# Altium project CHEM_CONTROL_BOX.PrjPcb (part 1 of 2)
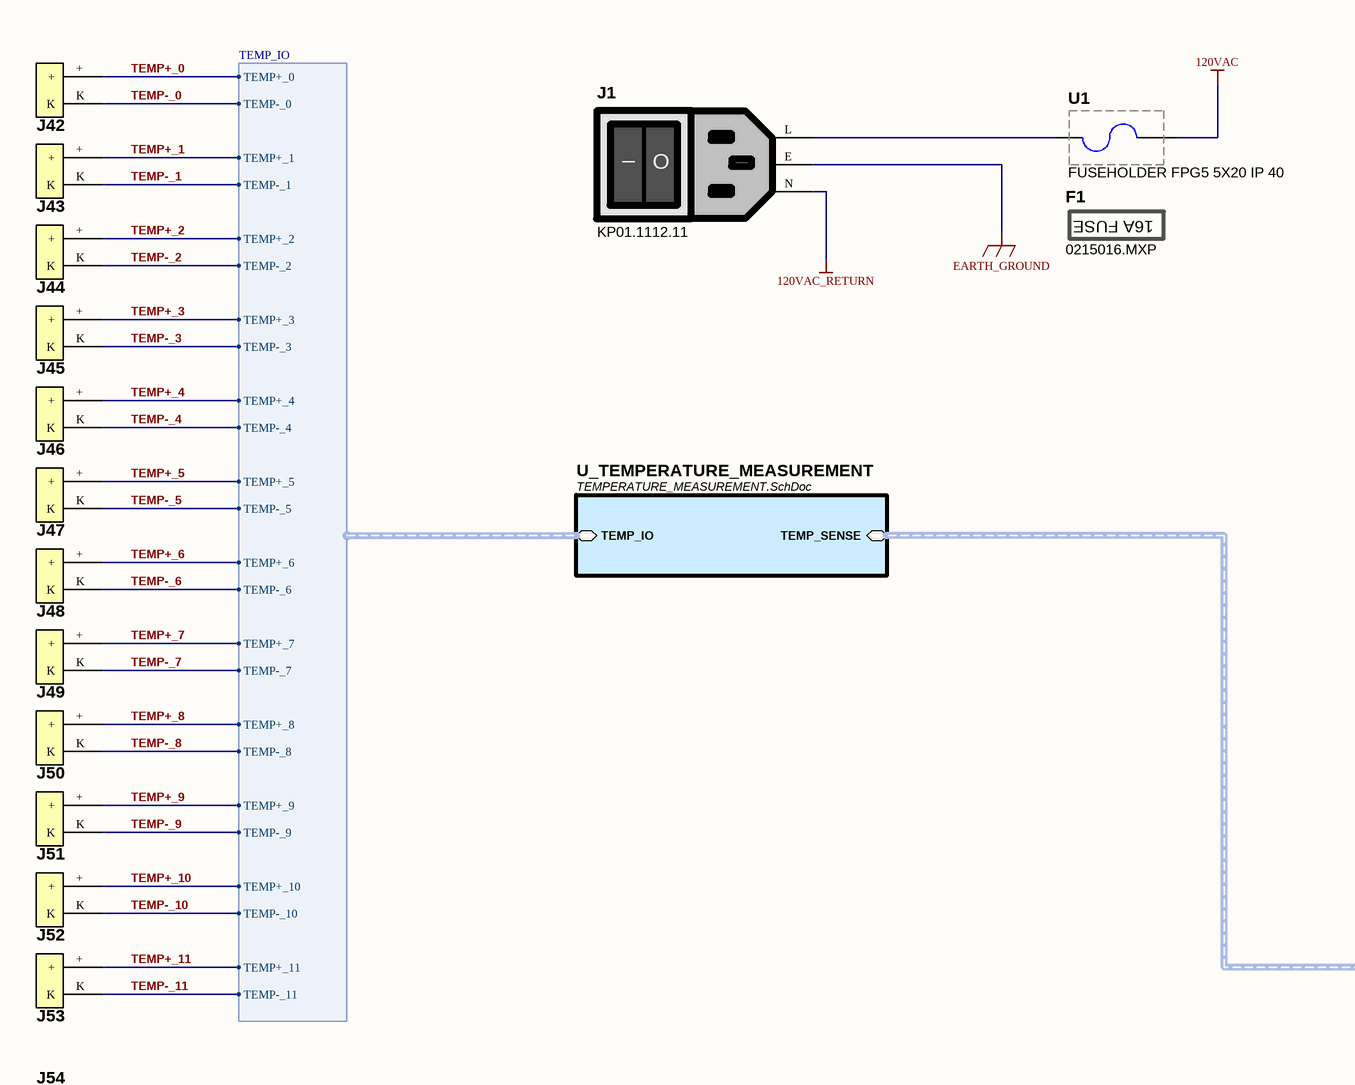
[diagram p0: CHEM_CONTROL_BOX.SchDoc, top left]
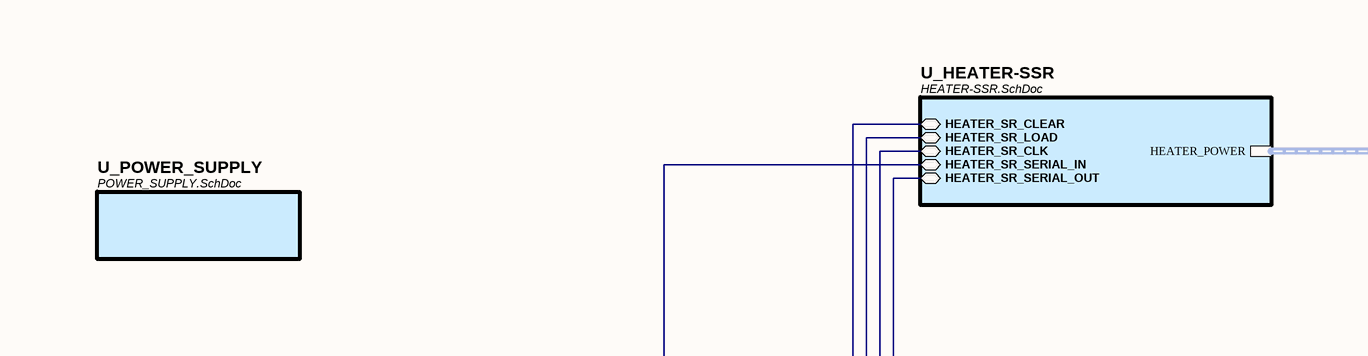
[diagram p1: CHEM_CONTROL_BOX.SchDoc, top middle]
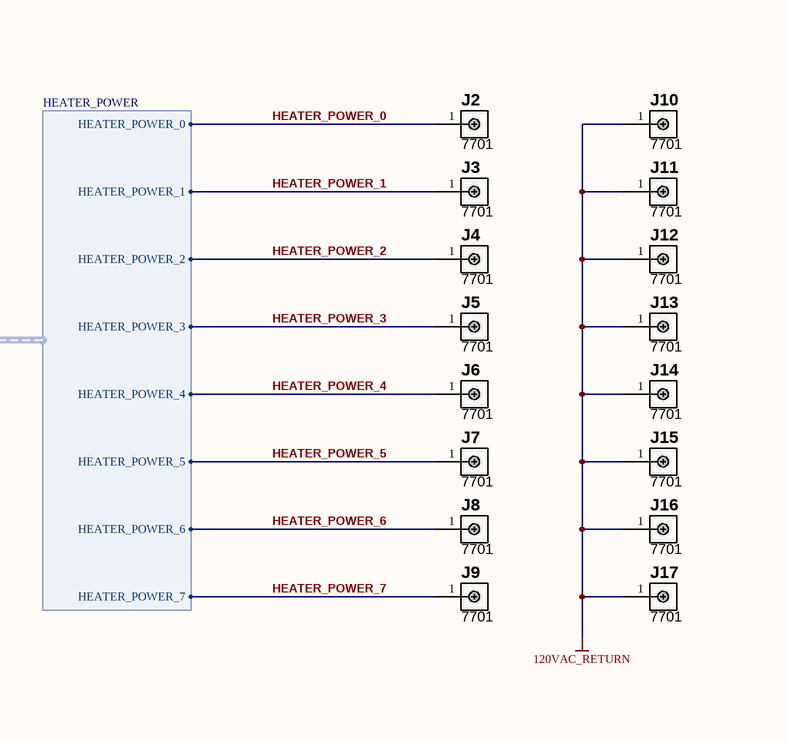
[diagram p2: CHEM_CONTROL_BOX.SchDoc, top right]
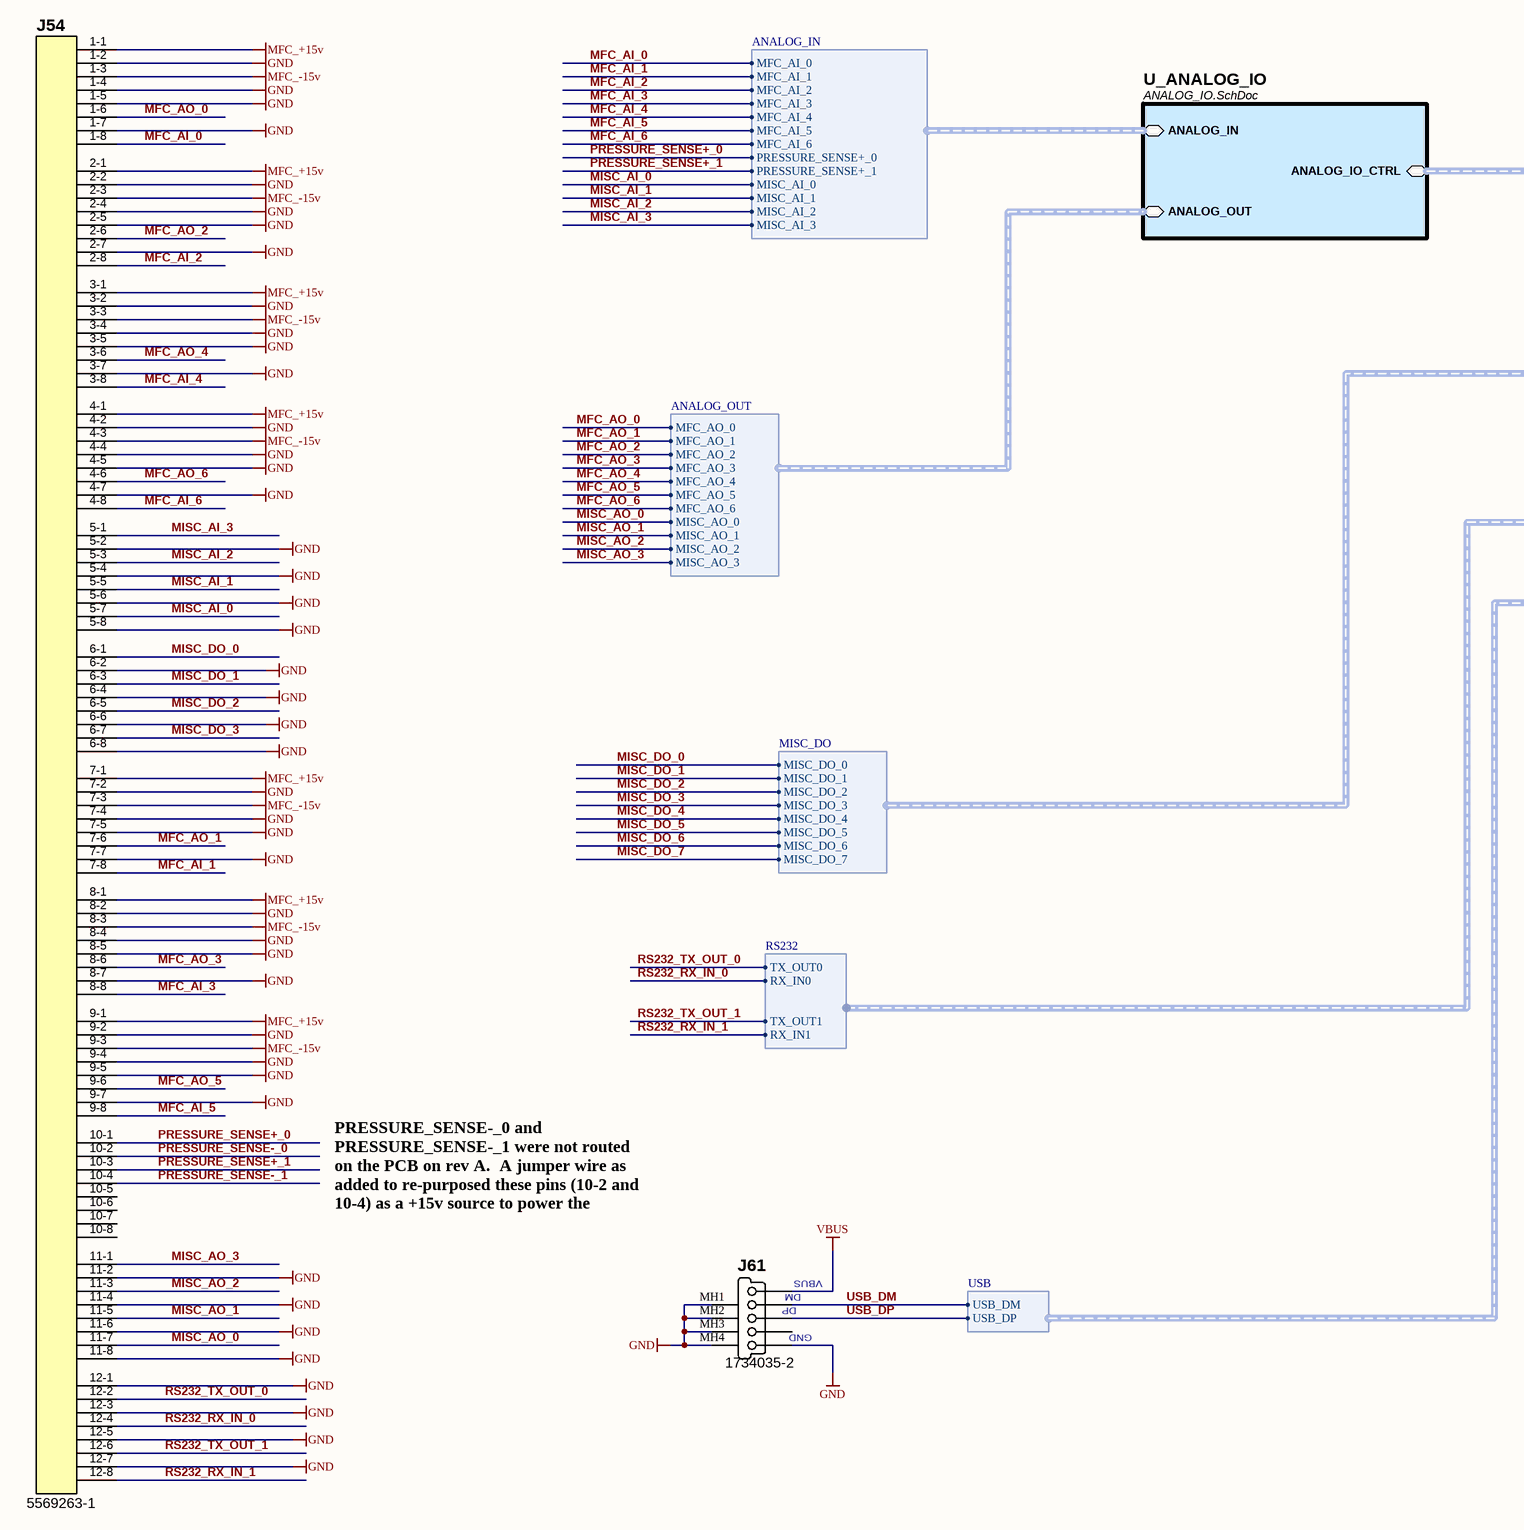
[diagram p3: CHEM_CONTROL_BOX.SchDoc, bottom left]
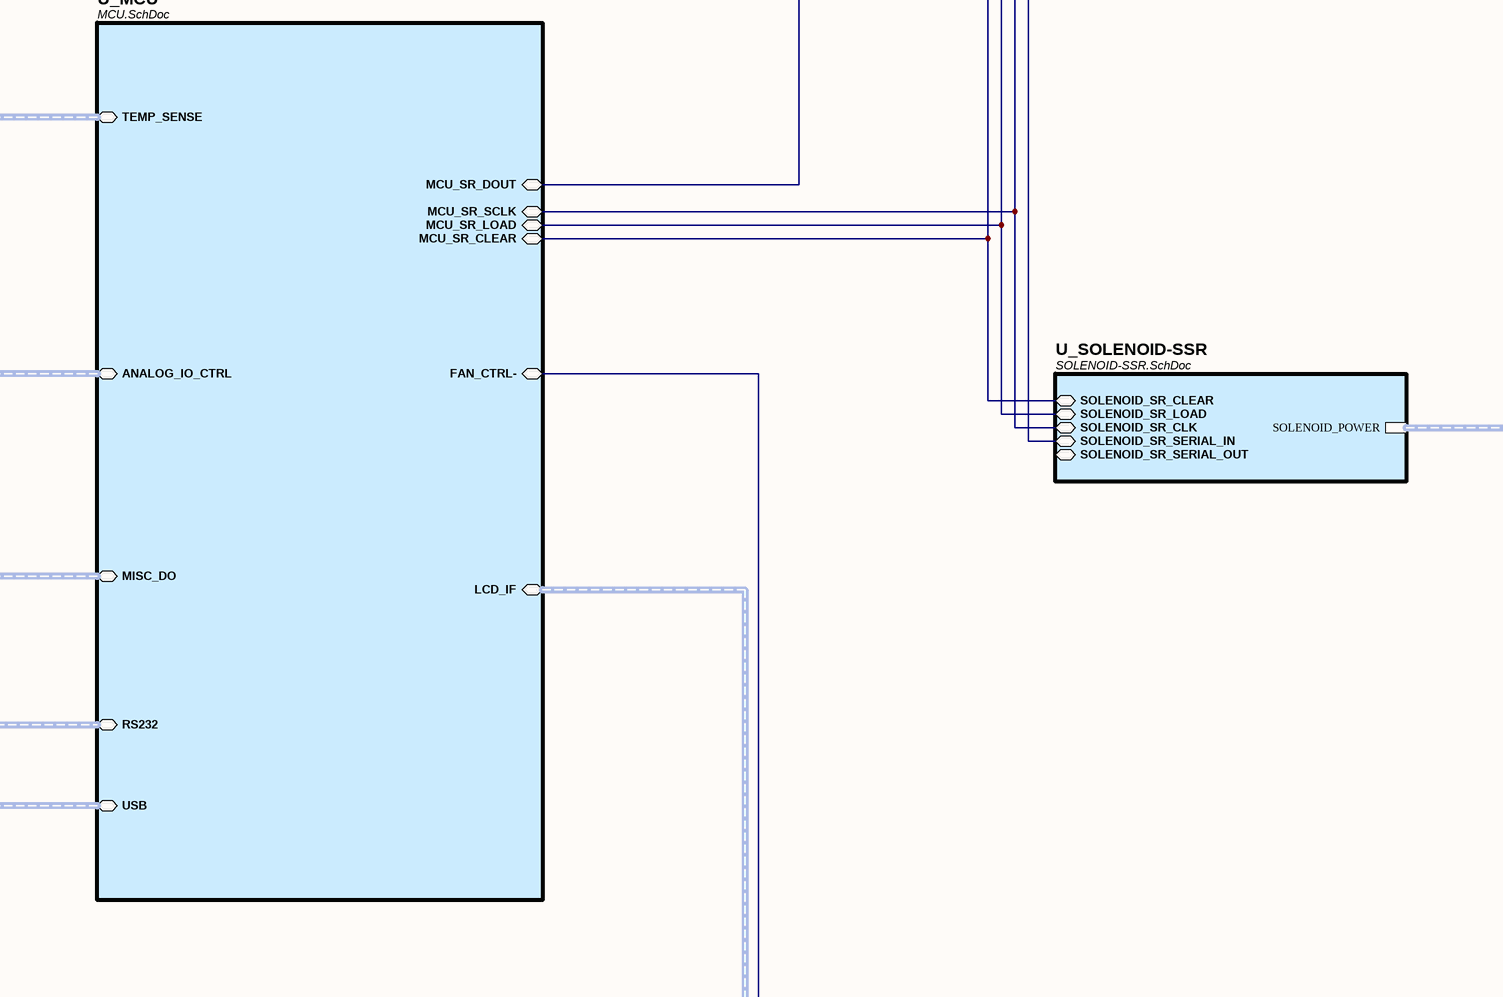
[diagram p4: CHEM_CONTROL_BOX.SchDoc, bottom middle]
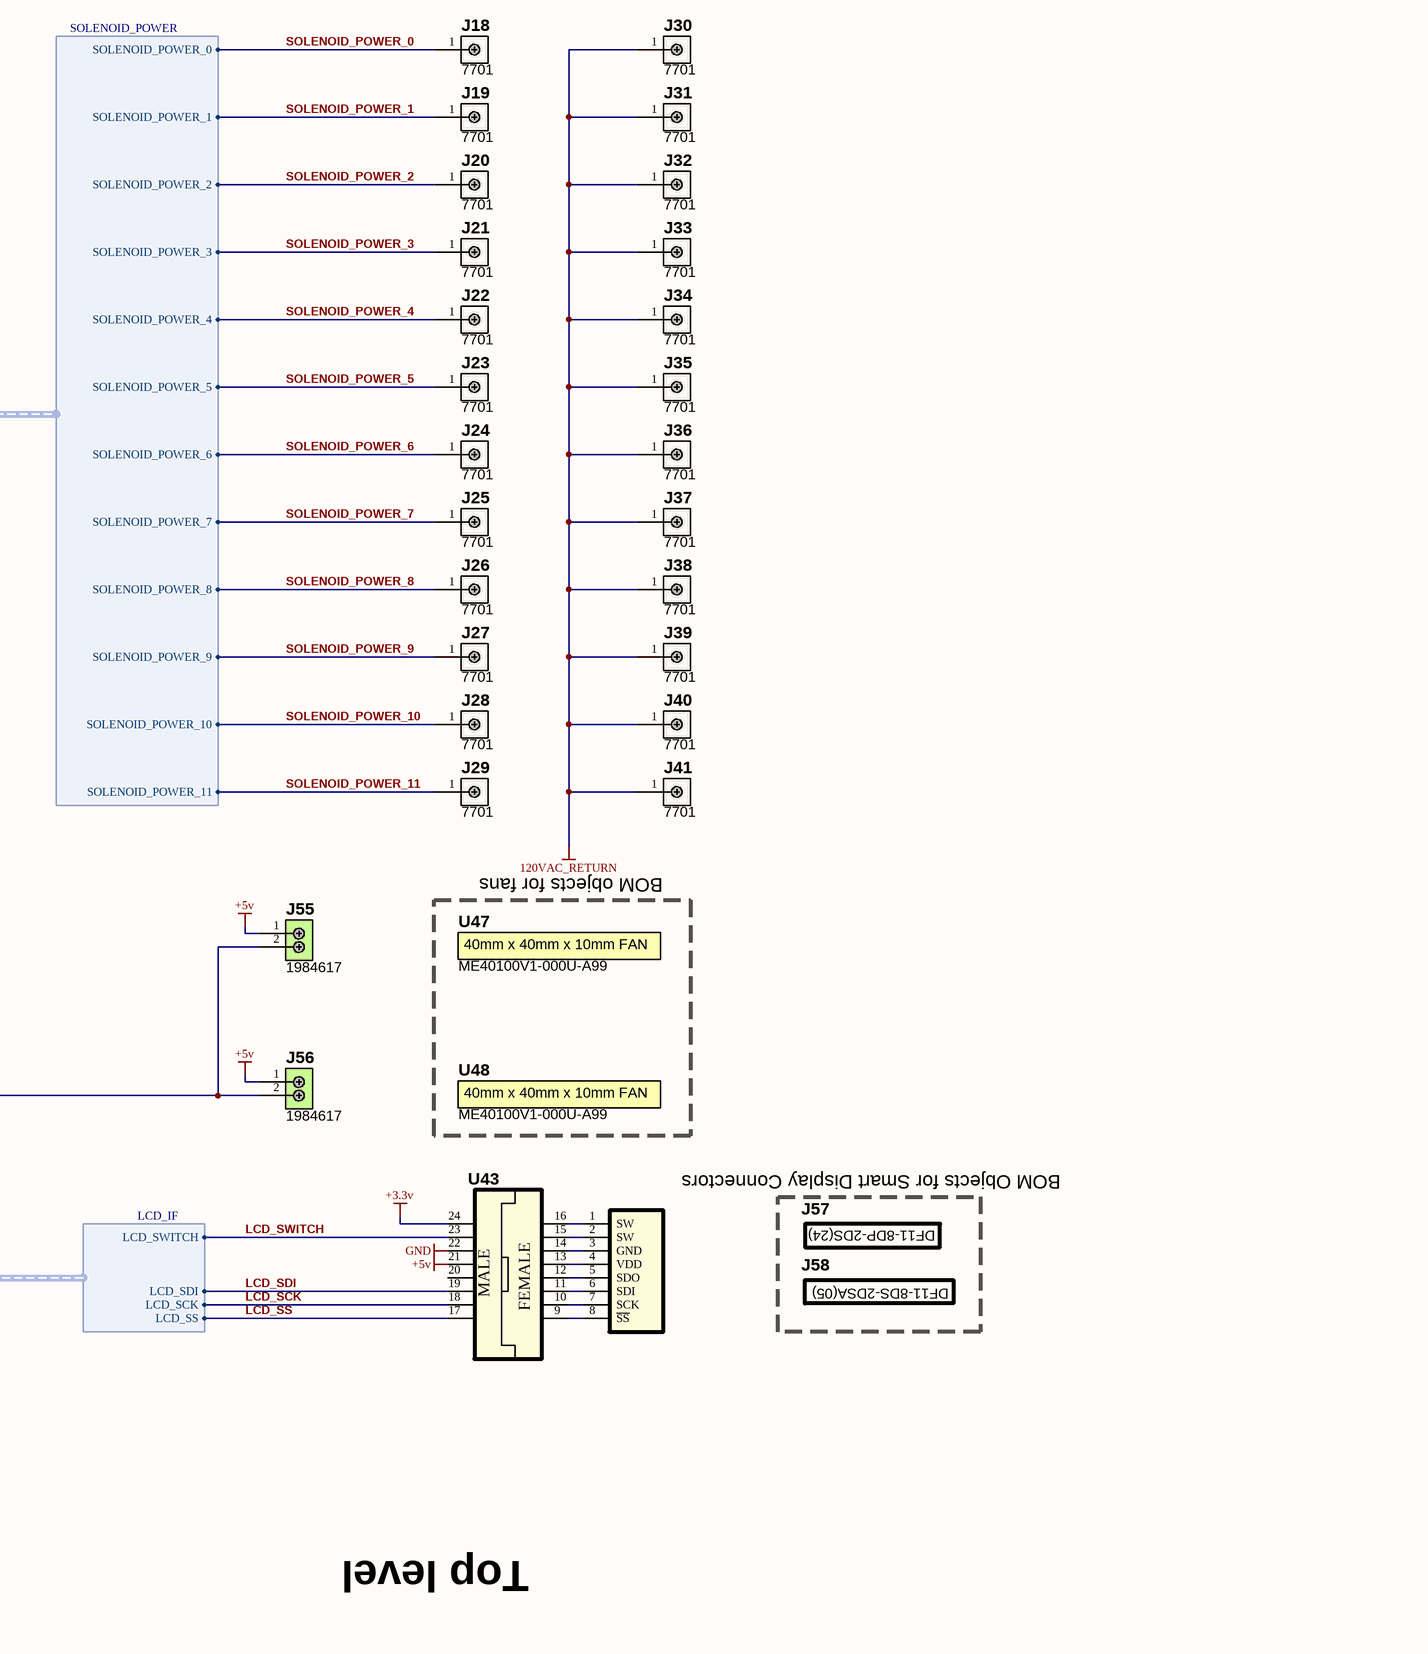
[diagram p5: CHEM_CONTROL_BOX.SchDoc, bottom right]
BOM_NOTES_LINE_1: -; BOM_NOTES_LINE_2: -; BOM_NOTES_LINE_3: -; BOM_NOTES_LINE_4: -; PCB_COPPER_WEIGHT_INNER: 2oz; PCB_COPPER_WEIGHT_OUTER: 2oz; PCB_DIMENSION_X: -; PCB_DIMENSION_Y: -; PCB_DRC_DATE: 2013.01.2; PCB_FINISH_PLATING: LEAD FREE HASL; PCB_FINISHED_THICKNESS: .0625"; PCB_LAYERS: 2; PCB_MATERIAL: FR4; PCB_MIN_DRILL: 15mil; PCB_MIN_TRACE_SPACE: 8mil; PCB_MIN_TRACE_WIDTH: 8mil; PCB_PRINTOUT_SCALE: 1:1; PCB_SILKSCREEN_COLOR_BOTTOM: WHITE; PCB_SILKSCREEN_COLOR_TOP: WHITE; PCB_SOLDER_MASK_COLOR_BOTTOM: BLUE; PCB_SOLDER_MASK_COLOR_TOP: BLUE; PROJECT_ENGINEER: E.Hughes; PROJECT_PART_NUMBER_CCA: -; PROJECT_PART_NUMBER_PCB: -; PROJECT_PART_NUMBER_SCH: -; PROJECT_REVISION: b; PROJECT_SHORT_TITLE: CHEM_BOX; PROJECT_STATUS: PROTOTYPE; PROJECT_TITLE_LINE_1: Chem Control Box; SCH_DATE: 2014.1.2
5 sheets, 215 parts. Net scope: hierarchical (ports join the sheet entries above them; power ports are global).
Board file: CHEM_CONTROL_BOX.PcbDoc
Sheets:
  CHEM_CONTROL_BOX.SchDoc
    U_MCU = MCU.SchDoc
    U_POWER_SUPPLY = POWER_SUPPLY.SchDoc
    U_TEMPERATURE_MEASUREMENT = TEMPERATURE_MEASUREMENT.SchDoc
    U_ANALOG_IO = ANALOG_IO.SchDoc

## Sheet CHEM_CONTROL_BOX.SchDoc
size D; Organization: Altium Limited; Address1: 3 Minna Close; Address2: Belrose; Address3: NSW 2085; Address4: Australia; SheetNumber: 1; SheetTotal: 7

### Parts
F1  0215016.MXP  (mechanical)
J1  KP01.1112.11  [KP01.1112.11]
J2  7701  [7701]
J3  7701  [7701]
J4  7701  [7701]
J5  7701  [7701]
J6  7701  [7701]
J7  7701  [7701]
J8  7701  [7701]
J9  7701  [7701]
J10  7701  [7701]
J11  7701  [7701]
J12  7701  [7701]
J13  7701  [7701]
J14  7701  [7701]
J15  7701  [7701]
J16  7701  [7701]
J17  7701  [7701]
J18  7701  [7701]
J19  7701  [7701]
J20  7701  [7701]
J21  7701  [7701]
J22  7701  [7701]
J23  7701  [7701]
J24  7701  [7701]
J25  7701  [7701]
J26  7701  [7701]
J27  7701  [7701]
J28  7701  [7701]
J29  7701  [7701]
J30  7701  [7701]
J31  7701  [7701]
J32  7701  [7701]
J33  7701  [7701]
J34  7701  [7701]
J35  7701  [7701]
J36  7701  [7701]
J37  7701  [7701]
J38  7701  [7701]
J39  7701  [7701]
J40  7701  [7701]
J41  7701  [7701]
J42  PCC-SMP-K  [PCC-SMP-V]  (value not drawn)
J43  PCC-SMP-K  [PCC-SMP-V]  (value not drawn)
J44  PCC-SMP-K  [PCC-SMP-V]  (value not drawn)
J45  PCC-SMP-K  [PCC-SMP-V]  (value not drawn)
J46  PCC-SMP-K  [PCC-SMP-V]  (value not drawn)
J47  PCC-SMP-K  [PCC-SMP-V]  (value not drawn)
J48  PCC-SMP-K  [PCC-SMP-V]  (value not drawn)
J49  PCC-SMP-K  [PCC-SMP-V]  (value not drawn)
J50  PCC-SMP-K  [PCC-SMP-V]  (value not drawn)
J51  PCC-SMP-K  [PCC-SMP-V]  (value not drawn)
J52  PCC-SMP-K  [PCC-SMP-V]  (value not drawn)
J53  PCC-SMP-K  [PCC-SMP-V]  (value not drawn)
J54  5569263-1  [5569263-1]
J55  1984617  [1984617]
J56  1984617  [1984617]
J57  DF11-8DP-2DS(24)  (value not drawn)  (mechanical)
J58  DF11-8DS-2DSA(05)  (value not drawn)  (mechanical)
J61  1734035-2  [1734035-2]
U1  FUSEHOLDER FPG5 5X20 IP 40  [3101.0055]
U43  IS15DSBFP4RGB  [R/A IS15DSBFP4RGB]  (value not drawn)
U47  ME40100V1-000U-A99  [ME40100V1-000U-A99]
U48  ME40100V1-000U-A99  [ME40100V1-000U-A99]

### Sub-sheets
U_ANALOG_IO = ANALOG_IO.SchDoc: ANALOG_IN (harness ANALOG_IN), ANALOG_OUT (harness ANALOG_OUT), ANALOG_IO_CTRL (harness ANALOG_IO_CTRL)
U_HEATER-SSR = HEATER-SSR.SchDoc (file not in this document): HEATER_POWER (harness HEATER_POWER), HEATER_SR_CLEAR, HEATER_SR_LOAD, HEATER_SR_CLK, HEATER_SR_SERIAL_IN, HEATER_SR_SERIAL_OUT
U_MCU = MCU.SchDoc: ANALOG_IO_CTRL (harness ANALOG_IO_CTRL), TEMP_SENSE (harness TEMP_SENSE), LCD_IF (harness LCD_IF), FAN_CTRL-, MISC_DO (harness MISC_DO), RS232 (harness RS232), MCU_SR_DOUT, MCU_SR_SCLK, MCU_SR_LOAD, MCU_SR_CLEAR, USB (harness USB)
U_POWER_SUPPLY = POWER_SUPPLY.SchDoc: no entries
U_SOLENOID-SSR = SOLENOID-SSR.SchDoc (file not in this document): SOLENOID_POWER (harness SOLENOID_POWER), SOLENOID_SR_CLEAR, SOLENOID_SR_LOAD, SOLENOID_SR_CLK, SOLENOID_SR_SERIAL_IN, SOLENOID_SR_SERIAL_OUT
U_TEMPERATURE_MEASUREMENT = TEMPERATURE_MEASUREMENT.SchDoc: TEMP_IO (harness TEMP_IO), TEMP_SENSE (harness TEMP_SENSE)

### Harnesses
HEATER_POWER: HEATER_POWER_0, HEATER_POWER_1, HEATER_POWER_2, HEATER_POWER_3, HEATER_POWER_4, HEATER_POWER_5, HEATER_POWER_6, HEATER_POWER_7
SOLENOID_POWER: SOLENOID_POWER_0, SOLENOID_POWER_1, SOLENOID_POWER_2, SOLENOID_POWER_3, SOLENOID_POWER_4, SOLENOID_POWER_5, SOLENOID_POWER_6, SOLENOID_POWER_7, SOLENOID_POWER_8, SOLENOID_POWER_9, SOLENOID_POWER_10, SOLENOID_POWER_11
TEMP_IO: TEMP-_0, TEMP+_0, TEMP+_1, TEMP-_1, TEMP+_2, TEMP-_2, TEMP+_3, TEMP-_3, TEMP+_4, TEMP-_4, TEMP+_5, TEMP-_5, TEMP+_6, TEMP-_6, TEMP+_7, TEMP-_7, TEMP+_8, TEMP-_8, TEMP+_9, TEMP-_9, TEMP+_10, TEMP-_10, TEMP+_11, TEMP-_11
ANALOG_OUT: MFC_AO_0, MFC_AO_1, MFC_AO_2, MFC_AO_3, MFC_AO_4, MFC_AO_5, MFC_AO_6, MISC_AO_0, MISC_AO_1, MISC_AO_2, MISC_AO_3
ANALOG_IN: MFC_AI_0, MFC_AI_1, MFC_AI_2, MFC_AI_3, MFC_AI_4, MFC_AI_5, MFC_AI_6, PRESSURE_SENSE+_0, PRESSURE_SENSE+_1, MISC_AI_0, MISC_AI_1, MISC_AI_2, MISC_AI_3
LCD_IF: LCD_SWITCH, LCD_SDI, LCD_SCK, LCD_SS
MISC_DO: MISC_DO_0, MISC_DO_1, MISC_DO_2, MISC_DO_3, MISC_DO_4, MISC_DO_5, MISC_DO_6, MISC_DO_7
RS232: TX_OUT0, RX_IN0, TX_OUT1, RX_IN1
USB: USB_DM, USB_DP

### Nets
120VAC: U1.2
120VAC_RETURN: J1.N J10.1 J11.1 J12.1 J13.1 J14.1 J15.1 J16.1 J17.1 J30.1 J31.1 J32.1 J33.1 J34.1 J35.1 J36.1 J37.1 J38.1 J39.1 J40.1 J41.1
+3.3v: U43.24
+5v: J55.1 J56.1 U43.21
EARTH_GROUND: J1.E(G)
GND: J54.1-2 J54.1-4 J54.1-5 J54.1-7 J54.2-2 J54.2-4 J54.2-5 J54.2-7 J54.3-2 J54.3-4 J54.3-5 J54.3-7 J54.4-2 J54.4-4 J54.4-5 J54.4-7 J54.5-2 J54.5-4 J54.5-6 J54.5-8 J54.6-2 J54.6-4 J54.6-6 J54.6-8 J54.7-2 J54.7-4 J54.7-5 J54.7-7 J54.8-2 J54.8-4 J54.8-5 J54.8-7 J54.9-2 J54.9-4 J54.9-5 J54.9-7 J54.11-2 J54.11-4 J54.11-6 J54.11-8 J54.12-1 J54.12-3 J54.12-5 J54.12-7 J61.5(GND) J61.MH1(Tab) J61.MH2(Tab) J61.MH3(Tab) J61.MH4(Tab) U43.22
MFC_+15v: J54.1-1 J54.2-1 J54.3-1 J54.4-1 J54.7-1 J54.8-1 J54.9-1
MFC_-15v: J54.1-3 J54.2-3 J54.3-3 J54.4-3 J54.7-3 J54.8-3 J54.9-3
VBUS: J61.1(V_BUS_(5V))
HEATER_POWER_0: J2.1 ; sheet U_HEATER-SSR/HEATER_POWER.HEATER_POWER_0
HEATER_POWER_1: J3.1 ; sheet U_HEATER-SSR/HEATER_POWER.HEATER_POWER_1
HEATER_POWER_2: J4.1 ; sheet U_HEATER-SSR/HEATER_POWER.HEATER_POWER_2
HEATER_POWER_3: J5.1 ; sheet U_HEATER-SSR/HEATER_POWER.HEATER_POWER_3
HEATER_POWER_4: J6.1 ; sheet U_HEATER-SSR/HEATER_POWER.HEATER_POWER_4
HEATER_POWER_5: J7.1 ; sheet U_HEATER-SSR/HEATER_POWER.HEATER_POWER_5
HEATER_POWER_6: J8.1 ; sheet U_HEATER-SSR/HEATER_POWER.HEATER_POWER_6
HEATER_POWER_7: J9.1 ; sheet U_HEATER-SSR/HEATER_POWER.HEATER_POWER_7
LCD_SCK: U43.18 ; sheet U_HEATER-SSR/HEATER_SR_CLK, sheet U_SOLENOID-SSR/SOLENOID_SR_CLK, sheet U_MCU/MCU_SR_SCLK, sheet U_MCU/LCD_IF.LCD_SCK
LCD_SDI: U43.19 ; sheet U_MCU/LCD_IF.LCD_SDI
LCD_SS: U43.17 ; sheet U_MCU/LCD_IF.LCD_SS
LCD_SWITCH: U43.23 ; sheet U_MCU/LCD_IF.LCD_SWITCH
MCU_SR_CLEAR: sheet U_HEATER-SSR/HEATER_SR_CLEAR, sheet U_SOLENOID-SSR/SOLENOID_SR_CLEAR, sheet U_MCU/MCU_SR_CLEAR
MCU_SR_DOUT: sheet U_HEATER-SSR/HEATER_SR_SERIAL_IN, sheet U_MCU/MCU_SR_DOUT
MCU_SR_LOAD: sheet U_HEATER-SSR/HEATER_SR_LOAD, sheet U_SOLENOID-SSR/SOLENOID_SR_LOAD, sheet U_MCU/MCU_SR_LOAD
MFC_AI_0: J54.1-8 ; sheet U_ANALOG_IO/ANALOG_IN.MFC_AI_0
MFC_AI_1: J54.7-8 ; sheet U_ANALOG_IO/ANALOG_IN.MFC_AI_1
MFC_AI_2: J54.2-8 ; sheet U_ANALOG_IO/ANALOG_IN.MFC_AI_2
MFC_AI_3: J54.8-8 ; sheet U_ANALOG_IO/ANALOG_IN.MFC_AI_3
MFC_AI_4: J54.3-8 ; sheet U_ANALOG_IO/ANALOG_IN.MFC_AI_4
MFC_AI_5: J54.9-8 ; sheet U_ANALOG_IO/ANALOG_IN.MFC_AI_5
MFC_AI_6: J54.4-8 ; sheet U_ANALOG_IO/ANALOG_IN.MFC_AI_6
MFC_AO_0: J54.1-6 ; sheet U_ANALOG_IO/ANALOG_OUT.MFC_AO_0
MFC_AO_1: J54.7-6 ; sheet U_ANALOG_IO/ANALOG_OUT.MFC_AO_1
MFC_AO_2: J54.2-6 ; sheet U_ANALOG_IO/ANALOG_OUT.MFC_AO_2
MFC_AO_3: J54.8-6 ; sheet U_ANALOG_IO/ANALOG_OUT.MFC_AO_3
MFC_AO_4: J54.3-6 ; sheet U_ANALOG_IO/ANALOG_OUT.MFC_AO_4
MFC_AO_5: J54.9-6 ; sheet U_ANALOG_IO/ANALOG_OUT.MFC_AO_5
MFC_AO_6: J54.4-6 ; sheet U_ANALOG_IO/ANALOG_OUT.MFC_AO_6
MISC_AI_0: J54.5-7 ; sheet U_ANALOG_IO/ANALOG_IN.MISC_AI_0
MISC_AI_1: J54.5-5 ; sheet U_ANALOG_IO/ANALOG_IN.MISC_AI_1
MISC_AI_2: J54.5-3 ; sheet U_ANALOG_IO/ANALOG_IN.MISC_AI_2
MISC_AI_3: J54.5-1 ; sheet U_ANALOG_IO/ANALOG_IN.MISC_AI_3
MISC_AO_0: J54.11-7 ; sheet U_ANALOG_IO/ANALOG_OUT.MISC_AO_0
MISC_AO_1: J54.11-5 ; sheet U_ANALOG_IO/ANALOG_OUT.MISC_AO_1
MISC_AO_2: J54.11-3 ; sheet U_ANALOG_IO/ANALOG_OUT.MISC_AO_2
MISC_AO_3: J54.11-1 ; sheet U_ANALOG_IO/ANALOG_OUT.MISC_AO_3
MISC_DO_0: J54.6-1 ; sheet U_MCU/MISC_DO.MISC_DO_0
MISC_DO_1: J54.6-3 ; sheet U_MCU/MISC_DO.MISC_DO_1
MISC_DO_2: J54.6-5 ; sheet U_MCU/MISC_DO.MISC_DO_2
MISC_DO_3: J54.6-7 ; sheet U_MCU/MISC_DO.MISC_DO_3
PRESSURE_SENSE+_0: J54.10-1 ; sheet U_ANALOG_IO/ANALOG_IN.PRESSURE_SENSE+_0
PRESSURE_SENSE+_1: J54.10-3 ; sheet U_ANALOG_IO/ANALOG_IN.PRESSURE_SENSE+_1
PRESSURE_SENSE-_0: J54.10-2
PRESSURE_SENSE-_1: J54.10-4
RS232_RX_IN_0: J54.12-4 ; sheet U_MCU/RS232.RX_IN0
RS232_RX_IN_1: J54.12-8 ; sheet U_MCU/RS232.RX_IN1
RS232_TX_OUT_0: J54.12-2 ; sheet U_MCU/RS232.TX_OUT0
RS232_TX_OUT_1: J54.12-6 ; sheet U_MCU/RS232.TX_OUT1
SOLENOID_POWER_0: J18.1 ; sheet U_SOLENOID-SSR/SOLENOID_POWER.SOLENOID_POWER_0
SOLENOID_POWER_1: J19.1 ; sheet U_SOLENOID-SSR/SOLENOID_POWER.SOLENOID_POWER_1
SOLENOID_POWER_2: J20.1 ; sheet U_SOLENOID-SSR/SOLENOID_POWER.SOLENOID_POWER_2
SOLENOID_POWER_3: J21.1 ; sheet U_SOLENOID-SSR/SOLENOID_POWER.SOLENOID_POWER_3
SOLENOID_POWER_4: J22.1 ; sheet U_SOLENOID-SSR/SOLENOID_POWER.SOLENOID_POWER_4
SOLENOID_POWER_5: J23.1 ; sheet U_SOLENOID-SSR/SOLENOID_POWER.SOLENOID_POWER_5
SOLENOID_POWER_6: J24.1 ; sheet U_SOLENOID-SSR/SOLENOID_POWER.SOLENOID_POWER_6
SOLENOID_POWER_7: J25.1 ; sheet U_SOLENOID-SSR/SOLENOID_POWER.SOLENOID_POWER_7
SOLENOID_POWER_8: J26.1 ; sheet U_SOLENOID-SSR/SOLENOID_POWER.SOLENOID_POWER_8
SOLENOID_POWER_9: J27.1 ; sheet U_SOLENOID-SSR/SOLENOID_POWER.SOLENOID_POWER_9
SOLENOID_POWER_10: J28.1 ; sheet U_SOLENOID-SSR/SOLENOID_POWER.SOLENOID_POWER_10
SOLENOID_POWER_11: J29.1 ; sheet U_SOLENOID-SSR/SOLENOID_POWER.SOLENOID_POWER_11
TEMP+_0: J42.+ ; sheet U_TEMPERATURE_MEASUREMENT/TEMP_IO.TEMP+_0
TEMP+_1: J43.+ ; sheet U_TEMPERATURE_MEASUREMENT/TEMP_IO.TEMP+_1
TEMP+_2: J44.+ ; sheet U_TEMPERATURE_MEASUREMENT/TEMP_IO.TEMP+_2
TEMP+_3: J45.+ ; sheet U_TEMPERATURE_MEASUREMENT/TEMP_IO.TEMP+_3
TEMP+_4: J46.+ ; sheet U_TEMPERATURE_MEASUREMENT/TEMP_IO.TEMP+_4
TEMP+_5: J47.+ ; sheet U_TEMPERATURE_MEASUREMENT/TEMP_IO.TEMP+_5
TEMP+_6: J48.+ ; sheet U_TEMPERATURE_MEASUREMENT/TEMP_IO.TEMP+_6
TEMP+_7: J49.+ ; sheet U_TEMPERATURE_MEASUREMENT/TEMP_IO.TEMP+_7
TEMP+_8: J50.+ ; sheet U_TEMPERATURE_MEASUREMENT/TEMP_IO.TEMP+_8
TEMP+_9: J51.+ ; sheet U_TEMPERATURE_MEASUREMENT/TEMP_IO.TEMP+_9
TEMP+_10: J52.+ ; sheet U_TEMPERATURE_MEASUREMENT/TEMP_IO.TEMP+_10
TEMP+_11: J53.+ ; sheet U_TEMPERATURE_MEASUREMENT/TEMP_IO.TEMP+_11
TEMP-_0: J42.K ; sheet U_TEMPERATURE_MEASUREMENT/TEMP_IO.TEMP-_0
TEMP-_1: J43.K ; sheet U_TEMPERATURE_MEASUREMENT/TEMP_IO.TEMP-_1
TEMP-_2: J44.K ; sheet U_TEMPERATURE_MEASUREMENT/TEMP_IO.TEMP-_2
TEMP-_3: J45.K ; sheet U_TEMPERATURE_MEASUREMENT/TEMP_IO.TEMP-_3
TEMP-_4: J46.K ; sheet U_TEMPERATURE_MEASUREMENT/TEMP_IO.TEMP-_4
TEMP-_5: J47.K ; sheet U_TEMPERATURE_MEASUREMENT/TEMP_IO.TEMP-_5
TEMP-_6: J48.K ; sheet U_TEMPERATURE_MEASUREMENT/TEMP_IO.TEMP-_6
TEMP-_7: J49.K ; sheet U_TEMPERATURE_MEASUREMENT/TEMP_IO.TEMP-_7
TEMP-_8: J50.K ; sheet U_TEMPERATURE_MEASUREMENT/TEMP_IO.TEMP-_8
TEMP-_9: J51.K ; sheet U_TEMPERATURE_MEASUREMENT/TEMP_IO.TEMP-_9
TEMP-_10: J52.K ; sheet U_TEMPERATURE_MEASUREMENT/TEMP_IO.TEMP-_10
TEMP-_11: J53.K ; sheet U_TEMPERATURE_MEASUREMENT/TEMP_IO.TEMP-_11
USB_DM: J61.2(D-) ; sheet U_MCU/USB.USB_DM
USB_DP: J61.3(D+) ; sheet U_MCU/USB.USB_DP
NetC73_1: J55.2 J56.2 ; sheet U_MCU/FAN_CTRL-
NetJ1_L: J1.L U1.1
NetU43_1: U43.1(SW) U43.16
NetU43_2: U43.2(SW) U43.15
NetU43_3: U43.3(GND) U43.14
NetU43_4: U43.4(VDD) U43.13
NetU43_5: U43.5(SDO) U43.12
NetU43_6: U43.6(SDI) U43.11
NetU43_7: U43.7(SCK) U43.10
NetU43_8: U43.8(~{SS}) U43.9
(unnamed): sheet U_HEATER-SSR/HEATER_SR_SERIAL_OUT, sheet U_SOLENOID-SSR/SOLENOID_SR_SERIAL_IN

Not connected (* = marked no-connect by the designer): J54 10-5 10-6 10-7 10-8; J61 4(NC); U43 20

### Buses and harness runs
harness sheet U_ANALOG_IO/ANALOG_IO_CTRL = sheet U_MCU/ANALOG_IO_CTRL
harness sheet U_MCU/TEMP_SENSE = sheet U_TEMPERATURE_MEASUREMENT/TEMP_SENSE

### Notes on the sheet
- BOM objects for fans
- BOM Objects for Smart Display Connectors
- PRESSURE_SENSE-_0 and PRESSURE_SENSE-_1 were not routed on the PCB on rev A.  A jumper wire as added to re-purposed these pins (10-2 and 10-4) as a +15v source to power the pressure sensor
- Top level
- -1
- Wavenumber LLC
- 2pl
- Rev:
- Sheet
- of
- (in symbol 0215016.MXP) 16A FUSE
- (in symbol 1734035-2) VBUS; DM; DP
- (in symbol KP01.1112.11) _; O
- (in symbol ME40100V1-000U-A99) 40mm x 40mm x 10mm FAN
- (in symbol R/A IS15DSBFP4RGB) MALE; FEMALE

### Library data of the parts
F1 = 0215016.MXP: FUSE 16A 250VAC 5X20 SLOW; Manufacturer: Littelfuse Inc; Fuse Type: Cartridge, Ceramic; Voltage Rating - AC: 250V; Breaking Capacity @ Rated Voltage: 500A; Melting I²t: 1408; Approvals: PSE, SEMKO, UL; DC Cold Resistance: 0.0031 Ohm; Value: 0215016.MXP; Supplier 1: Digi-Key; Supplier Part Number 1: F6044-ND; Manufacturer Part Number: 0215016.MXP; RoHS: RoHS Compliant; Category: Circuit Protection; Stock 1: 800; Pricing 1: 1=1.61, 10=1.456, 25=1.3796, 50=1.1754, 100=0.9965, 250=0.97092, 500=0.8176, 1000=0.72818, 2500=0.68985 (USD); Packaging: Bulk; Current Rating: 16A; Voltage Rating - DC: -; Response Time: Slow; Package / Case: 5mm x 20mm; Mounting Type: Holder; Operating Temperature: -55°C ~ 125°C; Color: -; Size / Dimension: 0.205" Dia x 0.787" L (5.20mm x 20.00mm); ComponentLink1URL: http://www.littelfuse.com/data/en/Data_Sheets/Littelfuse_Fuse_215_Series.pdf; ComponentLink1Description: http://www.littelfuse.com/data/en/Data_Sheets/Littelfuse_Fuse_215_Series.pdf
J1 = KP01.1112.11: AC Power Entry Modules SNAP-N PCB 2-POLE; Manufacturer: Schurter; Connector Type: IEC-320 C-14; Current Rating: 10 A; Filtered: No; Switch Function: Switched; Voltage Rating: 250 V; Value: KP01.1112.11; Supplier 1: Mouser; Supplier Part Number 1: 693-KP01.1112.11; Manufacturer Part Number: KP01.1112.11; RoHS: RoHS Compliant; Category: AC Power Entry Modules; Stock 1: 316; Pricing 1: 1=15.82, 25=14.04, 50=12.65, 100=11.93, 200=10.48 (AUD); Fused: No; Housing Material: Thermoplastic; Operating Temperature Range: - 25 C to + 70 C; Product: Inlets; Series: KP; Termination Style: Quick Connect; Flammability Rating: UL 94 V-0; Mounting Style: Snap In; Product Category: Power Entry Modules; Standard Pack Qty: 50; RoHS - Mouser: Y; Minimum Order Quantity: 1; Reeling: False; ComponentLink1URL: http://www.schurterinc.com/pdf/english/typ_kp__switch_.pdf; ComponentLink1Description: http://www.schurterinc.com/pdf/english/typ_kp__switch_.pdf
J2-J41 = 7701: TERM W/ASSEMBLD SCREW VERT PCMNT; Manufacturer: Keystone Electronics; Screw Size: 6-32; Current Rating: 15A; Number of Legs: 4; Screw Material: Brass; Screw Finish: Nickel; Supplier 1: Digi-Key; Supplier Part Number 1: 7701K-ND; Manufacturer Part Number: 7701; RoHS: RoHS Compliant; Category: Connectors, Interconnects; Stock 1: 77817; Pricing 1: 1=0.49, 10=0.462, 50=0.449, 100=0.354, 250=0.32324, 500=0.30784, 1000=0.256, 2500=0.23088, 5000=0.22318 (USD); Terminal Type: Screw Terminal, Power Tap; Termination: Solder; Mounting Type: Through Hole; Features: -; Contact Finish: Tin; Contact Material: Brass; Material - Insulation: -; ComponentLink1URL: http://www.keyelco.com/product-pdf.cfm?p=1081; ComponentLink1Description: http://www.keyelco.com/product-pdf.cfm?p=1081; Value: 7701
J42-J53 = PCC-SMP-K-100: Vertical K type thermocouple connector - K; Manufacturer: Omega; Manufacturer Part Number]: PCC-SMP-K-100; Supplier 1: Omega; Value: PCC-SMP-K; Supplier Part Number 1: PCC-SMP-K-100
J54 = 5569263-1: CONN MOD JACK R/A 8P8C SHIELDED; Manufacturer: TE Connectivity; Number of Positions/Contacts: 8p8c (RJ45, Ethernet); Number of Ports: 12; Shielding: Shielded, EMI Finger; Ratings: Cat5; LED Color: Does Not Contain LED; Tab Direction: Up and Down; Value: 5569263-1; Supplier 1: Digi-Key; Supplier Part Number 1: A31480-ND; Manufacturer Part Number: 5569263-1; RoHS: RoHS Compliant; Category: Connectors, Interconnects; Stock 1: 503; Pricing 1: 1=21.11, 10=19.055, 50=17.115, 100=16.5445, 250=15.63172, 500=15.1753, 1000=14.833 (USD); Packaging: Bulk; Connector Type: Jack; Number of Rows: 2; Mounting Type: Through Hole; Orientation: 90° Angle (Right); Termination: Solder; Features: Board Guide; Ingress Protection: -; Contact Material: Phosphor Bronze; Contact Finish: Gold; Contact Finish Thickness: 50µin (1.27µm); Housing Material: Polycyclohexylenedimethylene Terephthalate (PCT), Polyester; Operating Temperature: -40°C ~ 85°C; ComponentLink1URL: http://www.te.com/commerce/DocumentDelivery/DDEController?Action=srchrtrv&DocNm=5569263&DocType=Customer+Drawing&DocLang=English; ComponentLink1Description: http://www.te.com/commerce/DocumentDelivery/DDEController?Action=srchrtrv&DocNm=5569263&DocType=Customer+Drawing&DocLang=English
J55 J56 = 1984617: CONN TERM BLOCK T/H 2POS 3.5MM; Manufacturer: Phoenix Contact; Number of Levels: 1; Positions Per Level: 2; Pitch: 0.138" (3.50mm); Mating Orientation: Horizontal with Board; Current: 10A; Voltage: 300V; Wire Gauge: 16-26 AWG; Wire Termination: Screw - Rising Cage Clamp; Torque - Screw: 0.22-0.25 Nm (1.9-2.2 Lb-In); Screw Thread: M2; Supplier 1: Digi-Key; Supplier Part Number 1: 277-1721-ND; Manufacturer Part Number: 1984617; RoHS: RoHS Compliant; Category: Connectors, Interconnects; Stock 1: 10915; Pricing 1: 1=0.34, 10=0.322, 50=0.308, 100=0.2996, 250=0.28, 500=0.2576, 1000=0.238 (USD); Mounting Type: Through Hole; Features: Interlocking (Side); Color: Green; Packaging: Bulk; Operating Temperature: -; Housing Material: Polyamide (PA), Nylon; Contact Material - Plating: -; Clamp Material - Plating: -; Screw Material - Plating: -; ComponentLink1URL: http://media.digikey.com/pdf/Data%20Sheets/Phoenix%20Contact%20PDFs/1984617.pdf; ComponentLink1Description: http://media.digikey.com/pdf/Data%20Sheets/Phoenix%20Contact%20PDFs/1984617.pdf; Value: 1984617
J57 = DF11-8DP-2DS(24) (BOM ITEM): CONN HEADER 8POS 2MM RT ANG TIN; Manufacturer: Hirose Electric Co Ltd; Connector Type: Header, Shrouded; Number of Positions: 8; Number of Positions Loaded: All; Pitch: 0.079" (2.00mm); Supplier 1: Digi-Key; Manufacturer Part Number: DF11-8DP-2DS(24); RoHS: RoHS Compliant; Category: Connectors, Interconnects; Stock 1: 3605; Pricing 1: 1=0.87, 10=0.612, 50=0.472, 100=0.4108, 250=0.3496, 500=0.33212, 1000=0.29716, 2500=0.23598, 5000=0.23248 (USD); Packaging: Tube; Contact Type: Male Pin; Number of Rows: 2; Row Spacing: 0.079" (2.00mm); Contact Mating Length: 0.118" (3.00mm); Mounting Type: Through Hole, Right Angle; Termination: Solder; Fastening Type: Detent Lock; Features: -; Contact Finish: Tin; Contact Finish Thickness: -; Color: Black; ComponentLink1URL: http://www.hirose.co.jp/cataloge_hp/en_DF11_20130411.pdf; ComponentLink1Description: http://www.hirose.co.jp/cataloge_hp/en_DF11_20130411.pdf; Supplier Part Number 1: H10246-ND; Value: DF11-8DP-2DS(24)
J58 = DF11-8DS-2DSA(05) (BOM ITEM): CONN RECEPT 8POS 2MM PCB TIN; Manufacturer: Hirose Electric Co Ltd; Connector Type: Receptacle; Number of Positions: 8; Number of Positions Loaded: All; Pitch: 0.079" (2.00mm); Supplier 1: Digi-Key; Manufacturer Part Number: DF11-8DS-2DSA(05); RoHS: RoHS Compliant; Category: Connectors, Interconnects; Stock 1: 2569; Pricing 1: 1=1.14, 10=0.885, 25=0.8252, 50=0.75, 100=0.675, 250=0.57, 500=0.54, 1000=0.48, 2500=0.399 (USD); Packaging: Bulk; Contact Type: Female Socket; Number of Rows: 2; Row Spacing: 0.079" (2.00mm); Mounting Type: Through Hole; Termination: Press-Fit; Fastening Type: -; Features: -; Contact Finish: Tin; Contact Finish Thickness: -; Color: Black; ComponentLink1URL: http://www.hirose.co.jp/cataloge_hp/en_DF11_20130411.pdf; ComponentLink1Description: http://www.hirose.co.jp/cataloge_hp/en_DF11_20130411.pdf; Supplier Part Number 1: H10170-ND; Value: DF11-8DS-2DSA(05)
J61 = 1734035-2: Manufacturer: TE Connectivity; Connector Type: USB - mini B; Number of Contacts: 5; Gender: Receptacle; Specifications: USB 2.0; Supplier 1: Digi-Key; Supplier Part Number 1: A31727CT-ND; Manufacturer Part Number: 1734035-2; RoHS: RoHS Compliant; Category: Connectors, Interconnects; Stock 1: 133786; Pricing 1: 1=1.51, 10=1.325, 25=1.2476, 50=1.1956, 100=1.1435, 250=1.03956 (USD); Mounting Type: Surface Mount, Right Angle, Horizontal; Features: Board Guide; Packaging: Cut Tape (CT); Ingress Protection: -; ComponentLink1URL: http://documents.tycoelectronics.com/commerce/DocumentDelivery/DDEController?Action=srchrtrv&DocNm=1734035&DocType=CD&DocLang=EN; ComponentLink1Description: http://documents.tycoelectronics.com/commerce/DocumentDelivery/DDEController?Action=srchrtrv&DocNm=1734035&DocType=CD&DocLang=EN; Value: 1734035-2
U1 = 3101.0055: Manufacturer: Schurter Inc; Fuse Size: 5mm x 20mm; Number of Circuits: 1; Voltage: 250V; Current Rating: 16A; Value: FUSEHOLDER FPG5 5X20 IP 40; Supplier 1: Digi-Key; Supplier Part Number 1: 486-2056-ND; Manufacturer Part Number: 3101.0055; RoHS: RoHS Compliant; Category: Circuit Protection; Stock 1: 125; Pricing 1: 1=3.07, 25=2.454, 50=2.2086, 100=2.0859, 250=1.84052, 500=1.63192 (USD); Type: Holder; Mounting Type: PCB, Horizontal; Termination Style: PC Pin; Material: Copper Alloy, Tin Plated; ComponentLink1URL: http://www.schurterinc.com/var/schurter/storage/ilcatalogue/files/document/datasheet/en/pdf/typ_FPG5.pdf; ComponentLink1Description: http://www.schurterinc.com/var/schurter/storage/ilcatalogue/files/document/datasheet/en/pdf/typ_FPG5.pdf
U43 = R/A IS15DSBFP4RGB: 64x32 Compact Smart Switch; Manufacturer: NKK Switches; Male Connetor: DF11-8DP-2DS(24); Supplier 1: Mouser; Supplier Part Number 1: 633-IS15DSBFP4RGB; Value: IS15DSBFP4RGB; Manufacturer Part Number: IS15DSBFP4RGB
U47 U48 = ME40100V1-000U-A99: FAN 40X10MM 5VDC 1.08W 8CFM; Manufacturer: Sunon Fans; Air Flow: 8.0 CFM (0.226m&sup3;/min); Static Pressure: 0.190 in H2O (47.3 Pa); Bearing Type: Vapo-Bearing™; Fan Type: Tubeaxial; Noise: 32 dB(A); RPM: 7000 RPM; Current Rating: 0.215A; Material - Frame: Polybutylene Terephthalate (PBT); Value: ME40100V1-000U-A99; Supplier 1: Digi-Key; Supplier Part Number 1: 259-1575-ND; Manufacturer Part Number: ME40100V1-000U-A99; RoHS: RoHS Compliant; Category: Fans, Thermal Management; Stock 1: 4525; Pricing 1: 1=4.75, 10=4.356, 25=3.96, 50=3.564, 100=3.267, 250=3.11852, 500=2.9205, 1000=2.7225 (USD); Voltage - Rated: 5VDC; Features: -; Power (Watts): 1.08W; Size / Dimension: Square - 40mm L x 40mm H x 10mm W; Termination: 2 Wire Leads; Weight: 0.03 lb (13.61g); Operating Temperature: -; Voltage Range: -; Life Expectancy: -; Material - Blade: Polybutylene Terephthalate (PBT); ComponentLink1URL: http://www.sunon.com/uFiles/file/03_products/08-catalog%20download/Sunon%20DC%20Brushless%20Fan%20&%20Blower_(190-E).pdf; ComponentLink1Description: http://www.sunon.com/uFiles/file/03_products/08-catalog%20download/Sunon%20DC%20Brushless%20Fan%20&%20Blower_(190-E).pdf

## Sheet MCU.SchDoc
size D; SheetNumber: 3; SheetTotal: 7
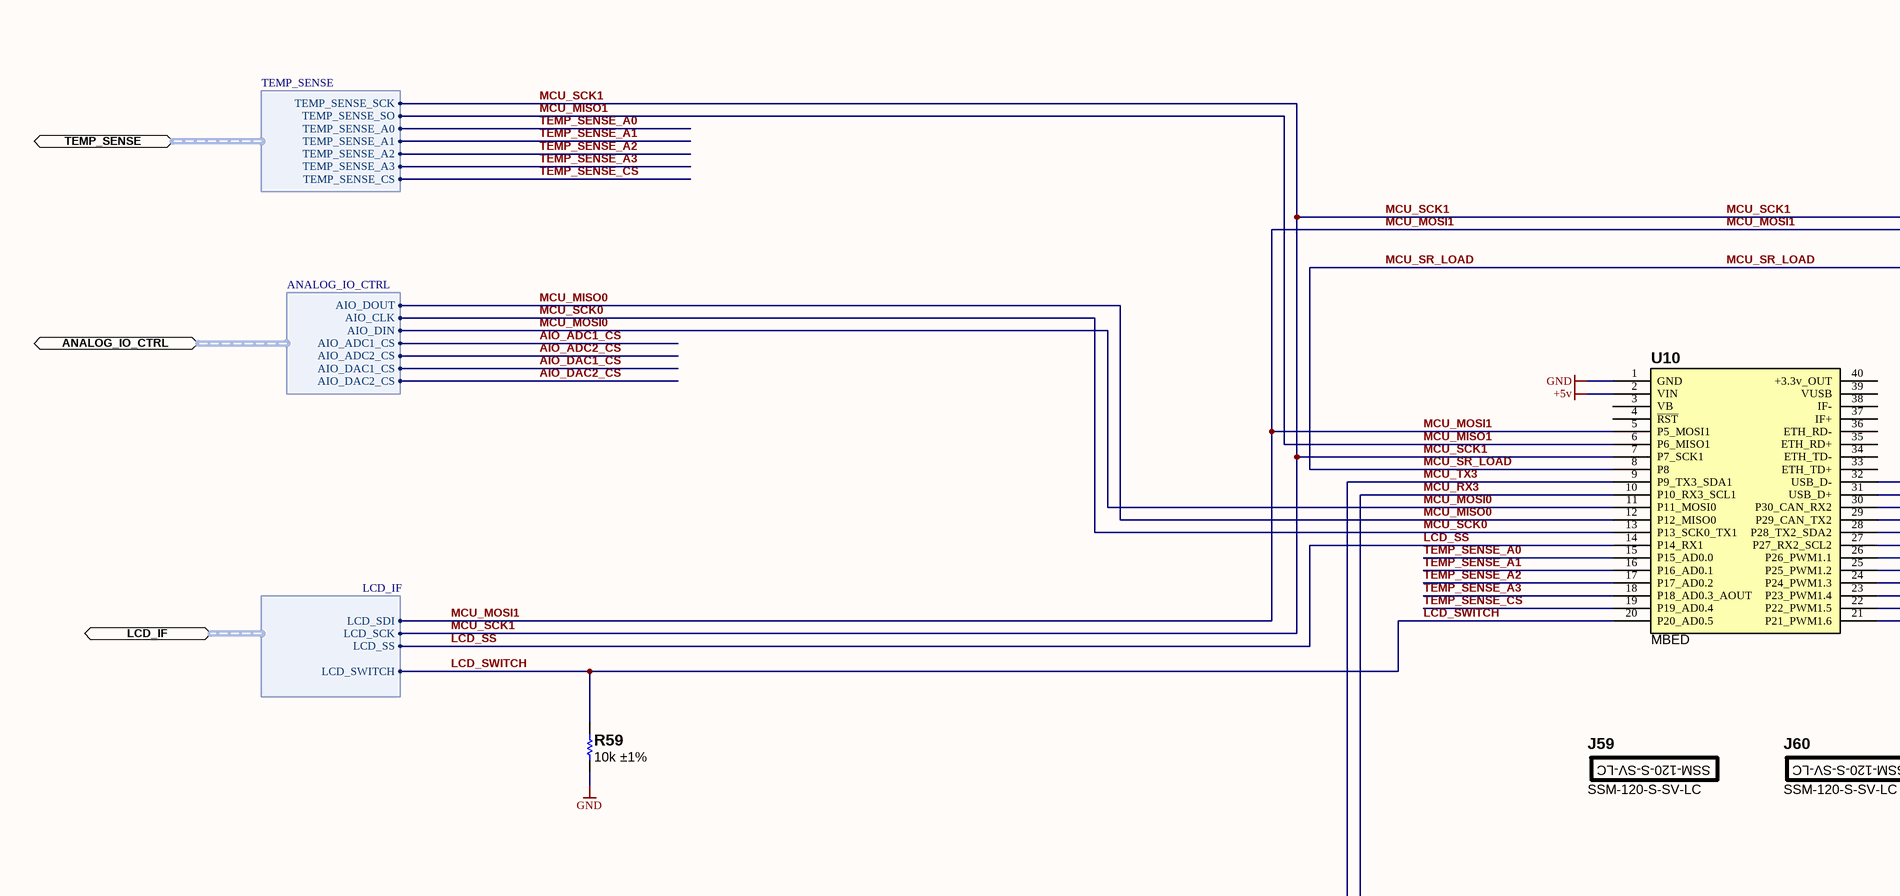
[diagram p6: MCU.SchDoc, top left]
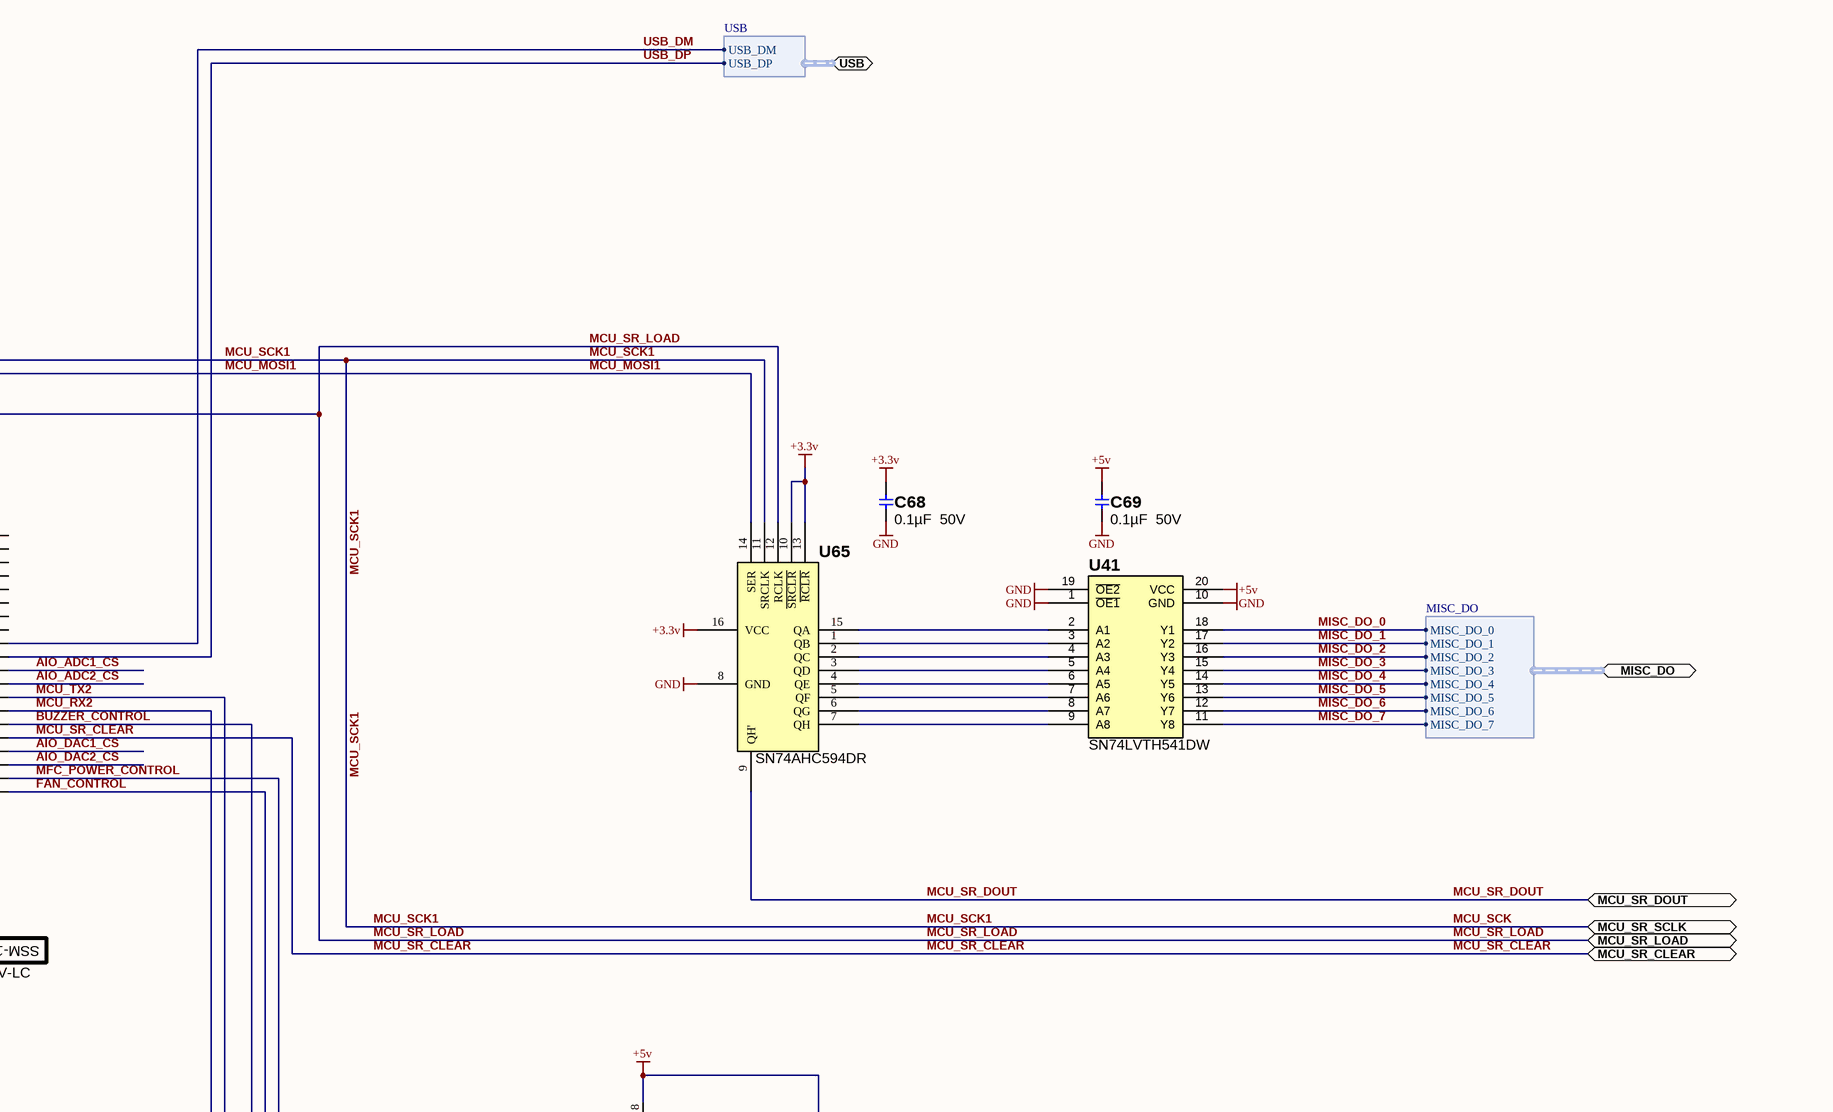
[diagram p7: MCU.SchDoc, top right]
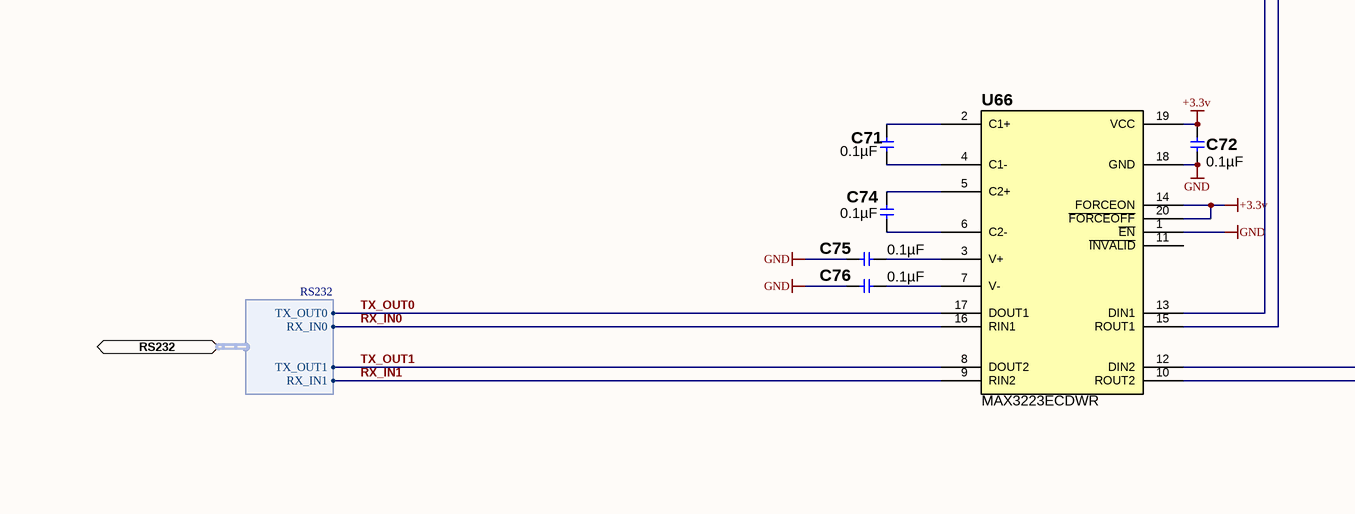
[diagram p8: MCU.SchDoc, bottom left]
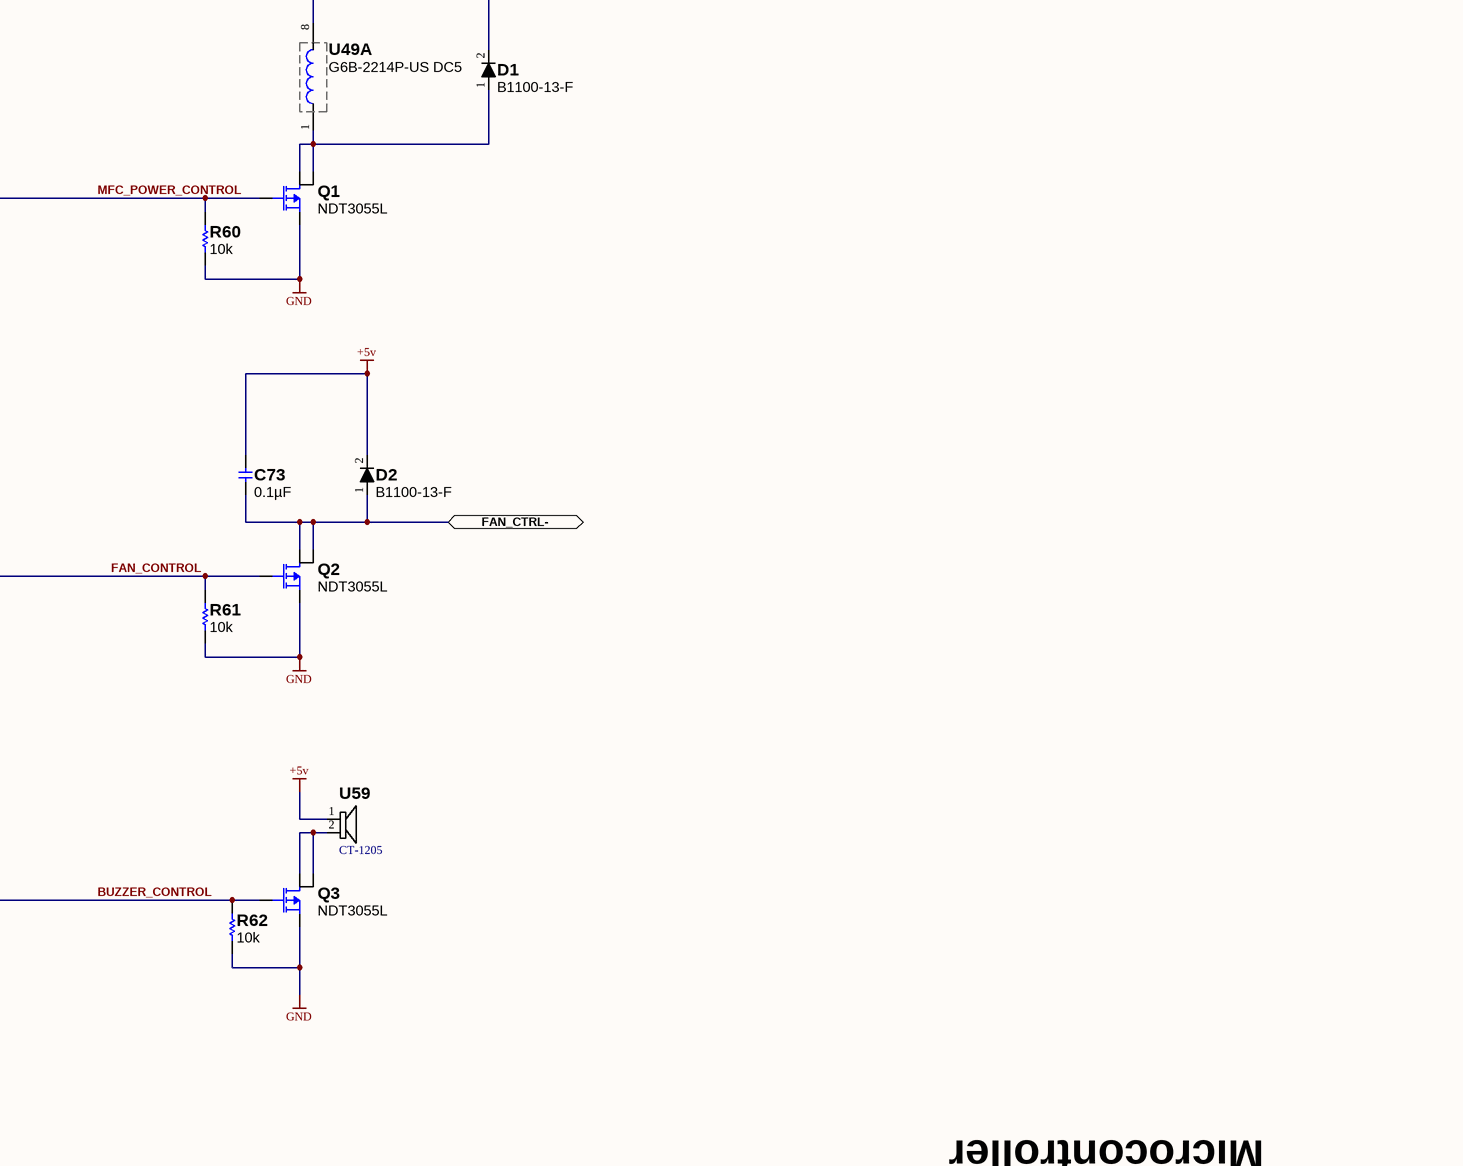
[diagram p9: MCU.SchDoc, bottom right]

### Parts
C68  0.1µF  50V  [C0805_LD]
C69  0.1µF  50V  [C0805_LD]
C71  0.1µF  [C0805_LD]
C72  0.1µF  [C0805_LD]
C73  0.1µF  [C0805_LD]
C74  0.1µF  [C0805_LD]
C75  0.1µF  [C0805_LD]
C76  0.1µF  [C0805_LD]
D1  B1100-13-F  [D_SMA_P]
D2  B1100-13-F  [D_SMA_P]
J59  SSM-120-S-SV-LC  (mechanical)
J60  SSM-120-S-SV-LC  (mechanical)
Q1  NDT3055L  [SOT223]
Q2  NDT3055L  [SOT223]
Q3  NDT3055L  [SOT223]
R59  10k ±1%  [R0805_LD]
R60  10k  [R0805_LD]
R61  10k  [R0805_LD]
R62  10k  [R0805_LD]
U10  MBED  [MBED_SURFACEMOUNT_SOCKET]
U41  SN74LVTH541DW  [SOIC127P1030X265-20L]
U49  G6B-2214P-US DC5  [G6B-2214P-US]  (part A of 2)
U59  CT-1205  [CT-1205]
U65  SN74AHC594DR  [SOIC127P600X145-16L]
U66  MAX3223ECDWR  [SOIC127P1030X265-20L]

### Ports
ANALOG_IO_CTRL (harness ANALOG_IO_CTRL), FAN_CTRL-, LCD_IF (harness LCD_IF), MCU_SR_CLEAR, MCU_SR_DOUT, MCU_SR_LOAD, MCU_SR_SCLK, MISC_DO (harness MISC_DO), RS232 (harness RS232), TEMP_SENSE (harness TEMP_SENSE), USB (harness USB)

### Harnesses
ANALOG_IO_CTRL: AIO_DOUT, AIO_CLK, AIO_DIN, AIO_ADC1_CS, AIO_ADC2_CS, AIO_DAC1_CS, AIO_DAC2_CS
TEMP_SENSE: TEMP_SENSE_SCK, TEMP_SENSE_SO, TEMP_SENSE_A0, TEMP_SENSE_A1, TEMP_SENSE_A2, TEMP_SENSE_A3, TEMP_SENSE_CS
LCD_IF: LCD_SWITCH, LCD_SDI, LCD_SCK, LCD_SS
MISC_DO: MISC_DO_0, MISC_DO_1, MISC_DO_2, MISC_DO_3, MISC_DO_4, MISC_DO_5, MISC_DO_6, MISC_DO_7
RS232: TX_OUT0, RX_IN0, TX_OUT1, RX_IN1
USB: USB_DM, USB_DP

### Nets
+3.3v: C68.2 C72.2 U65.10(~{SRCLR}) U65.13(~{RCLR}) U65.16(VCC) U66.14(FORCEON) U66.19(VCC) U66.20(~{FORCEOFF})
+5v: C69.2 C73.2 D1.2(K) D2.2(K) U10.2(VIN) U41.20(VCC) U49.8 U59.1(+)
GND: C68.1 C69.1 C72.1 C75.1 C76.1 Q1.3(S) Q2.3(S) Q3.3(S) R59.1 R60.1 R61.1 R62.1 U10.1(GND) U41.1(~{OE1}) U41.10(GND) U41.19(~{OE2}) U65.8(GND) U66.1(~{EN}) U66.18(GND)
AIO_ADC1_CS: U10.30(P30_CAN_RX2) ; port ANALOG_IO_CTRL.AIO_ADC1_CS
AIO_ADC2_CS: U10.29(P29_CAN_TX2) ; port ANALOG_IO_CTRL.AIO_ADC2_CS
AIO_DAC1_CS: U10.24(P24_PWM1.3) ; port ANALOG_IO_CTRL.AIO_DAC1_CS
AIO_DAC2_CS: U10.23(P23_PWM1.4) ; port ANALOG_IO_CTRL.AIO_DAC2_CS
BUZZER_CONTROL: Q3.1(G) R62.2 U10.26(P26_PWM1.1)
FAN_CONTROL: Q2.1(G) R61.2 U10.21(P21_PWM1.6)
LCD_SS: U10.14(P14_RX1) ; port LCD_IF.LCD_SS
LCD_SWITCH: R59.2 U10.20(P20_AD0.5) ; port LCD_IF.LCD_SWITCH
MCU_MISO0: U10.12(P12_MISO0) ; port ANALOG_IO_CTRL.AIO_DOUT  [project net AIO_DOUT]
MCU_MISO1: U10.6(P6_MISO1) ; port TEMP_SENSE.TEMP_SENSE_SO
MCU_MOSI0: U10.11(P11_MOSI0) ; port ANALOG_IO_CTRL.AIO_DIN  [project net AIO_DIN]
MCU_MOSI1: U10.5(P5_MOSI1) U65.14(SER) ; port LCD_IF.LCD_SDI  [project net LCD_SDI]
MCU_RX2: U10.27(P27_RX2_SCL2) U66.10(ROUT2)
MCU_RX3: U10.10(P10_RX3_SCL1) U66.15(ROUT1)
MCU_SCK: U10.7(P7_SCK1) U65.11(SRCLK) ; port MCU_SR_SCLK, port TEMP_SENSE.TEMP_SENSE_SCK, port LCD_IF.LCD_SCK  [also labelled MCU_SCK1]  [project net LCD_SCK]
MCU_SCK0: U10.13(P13_SCK0_TX1) ; port ANALOG_IO_CTRL.AIO_CLK  [project net AIO_CLK]
MCU_SR_CLEAR: U10.25(P25_PWM1.2) ; port MCU_SR_CLEAR
MCU_SR_DOUT: U65.9(QH') ; port MCU_SR_DOUT
MCU_SR_LOAD: U10.8(P8) U65.12(RCLK) ; port MCU_SR_LOAD
MCU_TX2: U10.28(P28_TX2_SDA2) U66.12(DIN2)
MCU_TX3: U10.9(P9_TX3_SDA1) U66.13(DIN1)
MFC_POWER_CONTROL: Q1.1(G) R60.2 U10.22(P22_PWM1.5)
MISC_DO_0: U41.18(Y1) ; port MISC_DO.MISC_DO_0
MISC_DO_1: U41.17(Y2) ; port MISC_DO.MISC_DO_1
MISC_DO_2: U41.16(Y3) ; port MISC_DO.MISC_DO_2
MISC_DO_3: U41.15(Y4) ; port MISC_DO.MISC_DO_3
MISC_DO_4: U41.14(Y5) ; port MISC_DO.MISC_DO_4
MISC_DO_5: U41.13(Y6) ; port MISC_DO.MISC_DO_5
MISC_DO_6: U41.12(Y7) ; port MISC_DO.MISC_DO_6
MISC_DO_7: U41.11(Y8) ; port MISC_DO.MISC_DO_7
RX_IN0: U66.16(RIN1) ; port RS232.RX_IN0  [project net RS232_RX_IN_0]
RX_IN1: U66.9(RIN2) ; port RS232.RX_IN1  [project net RS232_RX_IN_1]
TEMP_SENSE_A0: U10.15(P15_AD0.0) ; port TEMP_SENSE.TEMP_SENSE_A0
TEMP_SENSE_A1: U10.16(P16_AD0.1) ; port TEMP_SENSE.TEMP_SENSE_A1
TEMP_SENSE_A2: U10.17(P17_AD0.2) ; port TEMP_SENSE.TEMP_SENSE_A2
TEMP_SENSE_A3: U10.18(P18_AD0.3_AOUT) ; port TEMP_SENSE.TEMP_SENSE_A3
TEMP_SENSE_CS: U10.19(P19_AD0.4) ; port TEMP_SENSE.TEMP_SENSE_CS
TX_OUT0: U66.17(DOUT1) ; port RS232.TX_OUT0  [project net RS232_TX_OUT_0]
TX_OUT1: U66.8(DOUT2) ; port RS232.TX_OUT1  [project net RS232_TX_OUT_1]
USB_DM: U10.32(USB_D-) ; port USB.USB_DM
USB_DP: U10.31(USB_D+) ; port USB.USB_DP
NetC71_1: C71.1 U66.4(C1-)
NetC71_2: C71.2 U66.2(C1+)
NetC73_1: C73.1 D2.1(A) Q2.2(D) Q2.4(D) ; port FAN_CTRL-
NetC74_1: C74.1 U66.6(C2-)
NetC74_2: C74.2 U66.5(C2+)
NetC75_2: C75.2 U66.3(V+)
NetC76_2: C76.2 U66.7(V-)
NetD1_1: D1.1(A) Q1.2(D) Q1.4(D) U49.1
NetQ3_2: Q3.2(D) Q3.4(D) U59.2(-)
NetU41_2: U41.2(A1) U65.15(QA)
NetU41_3: U41.3(A2) U65.1(QB)
NetU41_4: U41.4(A3) U65.2(QC)
NetU41_5: U41.5(A4) U65.3(QD)
NetU41_6: U41.6(A5) U65.4(QE)
NetU41_7: U41.7(A6) U65.5(QF)
NetU41_8: U41.8(A7) U65.6(QG)
NetU41_9: U41.9(A8) U65.7(QH)

Not connected (* = marked no-connect by the designer): U10 3(VB) 4(~{RST}) 33(ETH_TD+) 34(ETH_TD-) 35(ETH_RD+) 36(ETH_RD-) 37(IF+) 38(IF-) 39(VUSB) 40(+3.3v_OUT); U66 11(~{INVALID})

### Notes on the sheet
- Microcontroller
- -1
- Wavenumber LLC
- 2pl
- Rev:
- Sheet
- of

### Library data of the parts
C68 C69 C71-C76 = GRM21BR71H104KA01L: CAP CER 0.1UF 50V 10% X7R 0805; Manufacturer: Murata Electronics North America; Temperature Coefficient: X7R; Manufacturer Part Number: GRM21BR71H104KA01L; ComponentLink1Description: \\altium.sil.arl.psu.edu\Libraries\datasheets\Murata Electronics North America\c02e.pdf; ComponentLink1URL: http://search.murata.co.jp/Ceramy/image/img/A01X/G101/ENG/GRM1555C1HR60WA01-01.pdf; ComponentLink2Description: External Datasheet; ComponentLink2URL: http://www.murata.com/products/catalog/pdf/c02e.pdf; Stocked: 0; Supplier 1: Digi-Key; Supplier Part Number 1: 490-1666-1-ND; Category: Capacitors; Sort Value: 100000; Sort Value Package: 0805_100000; Pricing: 1 = 0.1  ;  10 = 0.046  ;  50 = 0.0248  ;  100 = 0.0209  ;  250 = 0.01712  ;  500 = 0.01464  ;  1000 = 0.0114 (USD); Sales Status: Active; Capacitance: 0.1µF; Voltage - Rated: 50V; Tolerance: ±10%; Mounting Type: Surface Mount- MLCC; Operating Temperature: -55°C ~ 125°C; Applications: General Purpose; Ratings: -; Package / Case: 0805 (2012 Metric); Size / Dimension: 0.079" L x 0.049" W (2.00mm x 1.25mm); Height - Seated (Max): -; Thickness (Max): 0.053" (1.35mm); Lead Spacing: -; Features: -; Packaging: Cut Tape (CT); Lead Style: -; Package: 0805; Thickness: 135
  C68 C69: Value: 0.1µF  50V
  C71-C76: Value: 0.1µF
D1 D2 = B1100-13-F: DIODE SCHOTTKY 100V 1A SMA; Manufacturer: Diodes Inc; CategorySort: 400; Voltage - Forward (Vf) (Max) @ If: 790mV @ 1A; Speed: Fast Recovery =< 500ns- > 200mA (Io); Current - Reverse Leakage @ Vr: 500µA @ 100V; Capacitance @ Vr- F: 80pF @ 4V- 1MHz; Num Pins: 2; Diode Suffix: 1A_2C; Category: Diodes; Value: B1100-13-F; Manufacturer Part Number: B1100-13-F; ComponentLink1Description: Internal Datasheet; ComponentLink1URL: http://www.diodes.com/datasheets/ds30018.pdf; ComponentLink2Description: External Datasheet; ComponentLink2URL: http://www.diodes.com/datasheets/ds30018.pdf; Stocked: -; Supplier 1: Digi-Key; Supplier Part Number 1: B1100-FDICT-ND; SortValue: B1100-13-F; Pricing: 1 = 0.57  ;  10 = 0.4  ;  25 = 0.3288  ;  100 = 0.2627  ;  250 = 0.1914  ;  500 = 0.15544  ;  1000 = 0.11948  ;  2500 = 0.1073 (USD); Sales Status: Active; Diode Type: Schottky; Voltage - DC Reverse (Vr) (Max): 100V; Current - Average Rectified (Io): 1A; Reverse Recovery Time (trr): -; Mounting Type: Surface Mount; Package / Case: DO-214AC- SMA; Supplier Device Package: SMA; Packaging: Cut Tape (CT)
J59 J60 = SSM-120-S-SV-LC (BOM ITEM): SAMTEC - SSM-120-S-SV-LC - .025 SOCKET STRIPS; Supplier 1: Newark; Manufacturer: SAMTEC; Manufacturer Part Number: SSM-120-S-SV-LC; Stock 1: 0; Pricing 1: 1=4.98, 12500=4.38, 25000=4.14 (USD); Supplier Part Number 1: 81P6611
Q1-Q3 = NDT3055L: MOSFET N-CH 60V 4A SOT-223-4; Manufacturer: Fairchild Semiconductor; FET Type: MOSFET N-Channel, Metal Oxide; FET Feature: Logic Level Gate; Rds On (Max) @ Id, Vgs: 100 mOhm @ 4A, 10V; Vgs(th) (Max) @ Id: 2V @ 250µA; Gate Charge (Qg) @ Vgs: 20nC @ 10V; Input Capacitance (Ciss) @ Vds: 345pF @ 25V; Power - Max: 1.1W; Value: NDT3055L; Supplier 1: Digi-Key; Manufacturer Part Number: NDT3055L; RoHS: RoHS Compliant; Category: Discrete Semiconductor Products; Stock 1: 18949; Pricing 1: 1=0.69, 10=0.599, 100=0.4725, 250=0.40952, 500=0.3465, 750=0.29925, 1000=0.27563, 2000=0.252 (USD); Drain to Source Voltage (Vdss): 60V; Current - Continuous Drain (Id) @ 25° C: 4A; Mounting Type: Surface Mount; Package / Case: TO-261-4, TO-261AA; Packaging: Cut Tape (CT); Supplier Device Package: SOT-223-3; ComponentLink1URL: http://www.fairchildsemi.com/ds/ND/NDT3055L.pdf; ComponentLink1Description: http://www.fairchildsemi.com/ds/ND/NDT3055L.pdf; Supplier Part Number 1: NDT3055LCT-ND
R59-R62 = ERJ-6ENF1002V: RES 10K OHM 1/8W 1% 0805 SMD; Manufacturer: Panasonic Electronic Components; Package Power: 0805  (0.125W); Power (Watts): 0.125W- 1/8W; Temperature Coefficient: ±100ppm/°C; Limiting Element Voltage: 150; Maximum Overload Voltage: 200; Maximum Working Voltage: 35.4V; Manufacturer Part Number: ERJ-6ENF1002V; ComponentLink1Description: Internal Datasheet; ComponentLink1URL: \\altium.sil.arl.psu.edu\Libraries\datasheets\Panasonic Electronic Components\AOA0000CE2.pdf; ComponentLink2Description: External Datasheet; ComponentLink2URL: http://industrial.panasonic.com/www-data/pdf/AOA0000/AOA0000CE2.pdf; Stocked: 0; Supplier 1: Digi-Key; Supplier Part Number 1: P10.0KCCT-ND; Category: Resistors; Resistance (Ohms): 10k; Composition: Thick Film; Features: -; Tolerance: ±1%; Package / Case: 0805 (2012 Metric); Footprint: 805; Size / Dimension: 0.079" L x 0.049" W (2.00mm x 1.25mm); Height: 0.028" (0.70mm); Number of Terminations: 2; Packaging: Cut Tape (CT); Sort Value: 10000; Sort Value Package: 805_10000
  R59: Value: 10k ±1%
  R60-R62: Value: 10k
U10 = OM11043: DEVELOPMENT BOARD LPC1768 MBED; Manufacturer: NXP Semiconductors; Contents: Board and software; Value: MBED; Supplier 1: Digi-Key; Supplier Part Number 1: 568-4916-ND; Manufacturer Part Number: OM11043; RoHS: RoHS Compliant; Category: Programmers, Development Systems; Stock 1: 376; Pricing 1: 1=59 (USD); Type: MCU; For Use With/Related Products: LPC1768; ComponentLink1URL: http://ics.nxp.com/products/lpc1000/datasheet/lpc1763.lpc1764.lpc1765.lpc1766.lpc1767.lpc1768.lpc1769.pdf; ComponentLink1Description: http://ics.nxp.com/products/lpc1000/datasheet/lpc1763.lpc1764.lpc1765.lpc1766.lpc1767.lpc1768.lpc1769.pdf
U41 = SN74LVTH541DW: IC BUFF/DVR TRI-ST 8BIT 20SOIC; Manufacturer: Texas Instruments; Logic Type: Buffer/Line Driver, Non-Inverting; Number of Elements: 1; Number of Bits per Element: 8; Current - Output High, Low: 32mA, 64mA; Voltage - Supply: 2.7 V ~ 3.6 V; Value: SN74LVTH541DW; Supplier 1: Digi-Key; Supplier Part Number 1: 296-8728-5-ND; Manufacturer Part Number: SN74LVTH541DW; RoHS: RoHS Compliant; Category: Integrated Circuits (ICs); Stock 1: 8053; Pricing 1: 1=2.02, 25=1.6252, 100=1.4625, 250=1.3, 500=1.1375, 1000=0.9425, 2500=0.8775, 5000=0.845, 10000=0.8125 (USD); Packaging: Tube; Operating Temperature: -40°C ~ 85°C; Mounting Type: Surface Mount; Package / Case: 20-SOIC (0.295", 7.50mm Width); Supplier Device Package: 20-SOIC; ComponentLink1URL: http://www.ti.com/lit/ds/symlink/sn74lvth541.pdf; ComponentLink1Description: http://www.ti.com/lit/ds/symlink/sn74lvth541.pdf
U49 = G6B-2214P-US DC5: RELAY GENERAL PURPOSE DPST 5A 5V; Manufacturer: Omron Electronics Inc-EMC Div; Coil Type: Non Latching; Coil Current: 60mA; Coil Voltage: 5VDC; Contact Form: DPST (2 Form A); Switching Voltage: 380VAC, 125VDC - Max; Turn On Voltage (Max): 4 VDC; Turn Off Voltage (Min): 0.5 VDC; Operate Time: 10ms; Coil Power: 300 mW; Coil Resistance: 83.3 Ohms; Supplier 1: Digi-Key; Supplier Part Number 1: Z947-ND; Manufacturer Part Number: G6B-2214P-US DC5; RoHS: RoHS Compliant; Category: Relays; Stock 1: 2840; Pricing 1: 1=7.27, 10=6.816, 25=6.0584, 50=5.7556, 100=5.4526, 250=4.84676, 500=4.54384, 1000=4.24092, 2500=4.16519 (USD); Packaging: Bulk; Relay Type: General Purpose; Contact Rating (Current): 5A; Release Time: 10ms; Features: Sealed - Fully; Mounting Type: Through Hole; Termination Style: PC Pin; Contact Material: Silver Alloy, Cadmium Free; Operating Temperature: -25°C ~ 70°C; ComponentLink1URL: http://www.components.omron.com/components/web/PDFLIB.nsf/0/4287C4A29AD8E88785257201007DD690/$file/G6B_0911.pdf; ComponentLink1Description: http://www.components.omron.com/components/web/PDFLIB.nsf/0/4287C4A29AD8E88785257201007DD690/$file/G6B_0911.pdf; Value: G6B-2214P-US DC5
U59 = CT-1205: Source Part Number: 102-1199-2-ND; Manufacturer: CUI Inc; Driver Circuitry: Transducer, Externally Driven; Input Type: zero-peak Signal; Voltage - Rated: 5Vo-p; Voltage Range: 3 ~ 8V; Frequency: 2.4kHz; Operating Mode: Continuous; Sound Pressure Level: 87dB @ 5V, 10cm; Current - Supply: 40mA; Washable: Yes; Source: Digikey; Manufacturer Part Number: CT-1205; ROHS Certificate: *; Supplier 1: Digi-Key; Supplier Part Number 1: 102-1199-6-ND; RoHS: RoHS Compliant; Category: Audio Products; Stock 1: 10608; Pricing 1: 1=2.68, 10=2.222, 100=1.6456 (USD); Packaging: Digi-Reel®; Technology: Magnetic; Mounting Type: Surface Mount; Termination: Solder Pads; Size / Dimension: Square - 12.80mm L x 12.80mm W x 7.60mm H; Capacitance @ Frequency: -; Operating Temperature: -30°C ~ 85°C; ComponentLink1URL: http://www.cui.com/product/resource/digikeypdf/ct-1205-smt.pdf; ComponentLink1Description: http://www.cui.com/product/resource/digikeypdf/ct-1205-smt.pdf; Value: CT-1205
U65 = SN74AHC594DR: IC SHIFT REGISTER 8BIT 16-SOIC; Manufacturer: Texas Instruments; Output Type: Standard; Number of Elements: 1; Number of Bits per Element: 8; Function: Serial to Parallel; Voltage - Supply: 2 V ~ 5.5 V; Supplier 1: Digi-Key; Manufacturer Part Number: SN74AHC594DR; RoHS: RoHS Compliant; Category: Integrated Circuits (ICs); Stock 1: 1808; Pricing 1: 1=0.59, 10=0.494, 25=0.4332, 100=0.3708, 250=0.3216, 500=0.2724, 1000=0.21 (USD); Packaging: Cut Tape (CT); Logic Type: Shift Register; Operating Temperature: -40°C ~ 85°C; Mounting Type: Surface Mount; Package / Case: 16-SOIC (0.154", 3.90mm Width); Supplier Device Package: 16-SOIC N; ComponentLink1URL: http://www.ti.com/lit/ds/symlink/sn74ahc594.pdf; ComponentLink1Description: http://www.ti.com/lit/ds/symlink/sn74ahc594.pdf; Supplier Part Number 1: 296-31743-1-ND; Value: SN74AHC594DR
U66 = MAX3223ECDWR: IC RS232 3V5.5V DRVR ESD 20-SOIC; Manufacturer: Texas Instruments; Number of Drivers/Receivers: 2/2; Duplex: Full; Receiver Hysteresis: 500mV; Data Rate: 500kbps; Voltage - Supply: 3 V ~ 5.5 V; Value: MAX3223ECDWR; Supplier 1: Digi-Key; Supplier Part Number 1: 296-19839-1-ND; Manufacturer Part Number: MAX3223ECDWR; RoHS: RoHS Compliant; Category: Integrated Circuits (ICs); Stock 1: 2550; Pricing 1: 1=2.23, 10=2.016, 25=1.806, 100=1.624, 250=1.442, 500=1.26, 1000=1.043 (USD); Packaging: Cut Tape (CT); Type: Transceiver; Protocol: RS232; Operating Temperature: 0°C ~ 70°C; Mounting Type: Surface Mount; Package / Case: 20-SOIC (0.295", 7.50mm Width); Supplier Device Package: 20-SOIC; ComponentLink1URL: http://www.ti.com/lit/ds/symlink/max3223e.pdf; ComponentLink1Description: http://www.ti.com/lit/ds/symlink/max3223e.pdf

## Sheet POWER_SUPPLY.SchDoc
size D; SheetNumber: 6; SheetTotal: 7
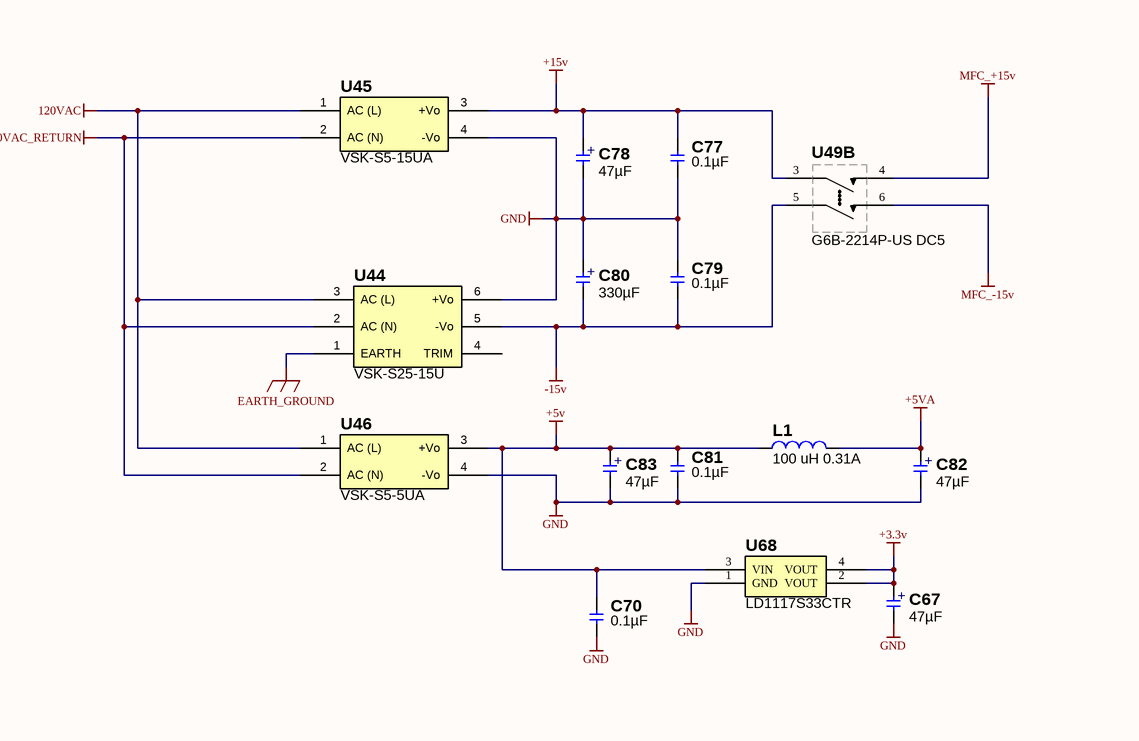
[diagram p10: POWER_SUPPLY.SchDoc, left]
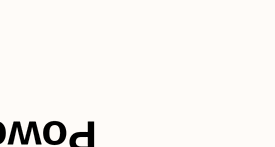
[diagram p11: POWER_SUPPLY.SchDoc, right]

### Parts
C67  47µF  [C_ALU_D]
C70  0.1µF  [C0805_LD]
C77  0.1µF  [C0805_LD]
C78  47µF  [C_ALU_D]
C79  0.1µF  [C0805_LD]
C80  330µF  [C_ALU_F]
C81  0.1µF  [C0805_LD]
C82  47µF  [C_ALU_D]
C83  47µF  [C_ALU_D]
L1  100 uH 0.31A  [L_DO1608C]
U44  VSK-S25-15U  [VSK-S25]
U45  VSK-S5-15UA  [VSK-S5]
U46  VSK-S5-5UA  [VSK-S5]
U49  G6B-2214P-US DC5  [G6B-2214P-US]  (part B of 2)
U68  LD1117S33CTR  [SOT223]

### Nets
120VAC: U44.3(AC_(L)) U45.1(AC_(L)) U46.1(AC_(L))
120VAC_RETURN: U44.2(AC_(N)) U45.2(AC_(N)) U46.2(AC_(N))
+3.3v: C67.1 U68.2(VOUT) U68.4(VOUT)
+5v: C70.2 C81.2 C83.1 L1.1 U46.3(+Vo) U68.3(VIN)
+5VA: C82.1 L1.2
+15v: C77.2 C78.1 U45.3(+Vo) U49.3
-15v: C79.1 C80.2 U44.5(-Vo) U49.5
EARTH_GROUND: U44.1(EARTH)
GND: C67.2 C70.1 C77.1 C78.2 C79.2 C80.1 C81.1 C82.2 C83.2 U44.6(+Vo) U45.4(-Vo) U46.4(-Vo) U68.1(GND)
MFC_+15v: U49.4
MFC_-15v: U49.6

Not connected (* = marked no-connect by the designer): U44 4(TRIM)

### Notes on the sheet
- Power Supply
- -1
- Wavenumber LLC
- 2pl
- Rev:
- Sheet
- of
- (in symbol EEE-FK1E331P) +
- (in symbol EEE-FK1E470P) +

### Library data of the parts
C67 C78 C82 C83 = EEE-FK1E470P: CAP ALUM 47UF 25V 20% SMD; Manufacturer: Panasonic Electronic Components; Lifetime @ Temp#: 2000 Hrs @ 105°C; Ripple Current: 240mA; Impedance: 360 mOhm; Surface Mount Land Size: 0.260" L x 0.260" W (6.60mm x 6.60mm); F40: 0P; Value: 47µF; Temperature Coefficient: Temperature Coefficient; Manufacturer Part Number: EEE-FK1E470P; ComponentLink1Description: Internal Datasheet; ComponentLink1URL: http://industrial.panasonic.com/www-cgi/jvcr13pz.cgi?E+PZ+3+ABA0120+EEEFK1E470P+7+WW; ComponentLink2Description: External Datasheet; ComponentLink2URL: http://industrial.panasonic.com/www-cgi/jvcr13pz.cgi?E+PZ+3+ABA0120+EEEFK1E470P+7+WW; Stocked: 0; Supplier 1: Digi-Key; Supplier Part Number 1: PCE3804CT-ND; Category: Capacitors; SortValue: 47000000; Sort Value Package: D_47000000; Pricing: 1 = 0.56  ;  50 = 0.3364  ;  100 = 0.2944  ;  250 = 0.23132  ;  500 = 0.2103 (USD); Sales Status: Active; Capacitance: 47µF; Voltage Rating: 25V; Tolerance: ±20%; Operating Temperature: -55°C ~ 105°C; Features: General Purpose; ESR (Equivalent Series Resistance): -; Mounting Type: Surface Mount; Package / Case: Radial- Can - SMD; Size / Dimension: 0.248" Dia (6.30mm); Height - Seated (Max): 0.228" (5.80mm); Lead Spacing: -; Packaging: Cut Tape (CT); Diameter: 6.30; Height: 5.80; Package: D
C70 C77 C79 C81 = GRM21BR71H104KA01L: as C68 on sheet MCU; Value: 0.1µF; Temperature Coefficient: X7R; Manufacturer Part Number: GRM21BR71H104KA01L; ComponentLink1Description: \\altium.sil.arl.psu.edu\Libraries\datasheets\Murata Electronics North America\c02e.pdf; ComponentLink1URL: http://search.murata.co.jp/Ceramy/image/img/A01X/G101/ENG/GRM1555C1HR60WA01-01.pdf; ComponentLink2Description: External Datasheet; ComponentLink2URL: http://www.murata.com/products/catalog/pdf/c02e.pdf; Stocked: 0; Supplier 1: Digi-Key; Supplier Part Number 1: 490-1666-1-ND; Category: Capacitors; Sort Value: 100000; Sort Value Package: 0805_100000; Pricing: 1 = 0.1  ;  10 = 0.046  ;  50 = 0.0248  ;  100 = 0.0209  ;  250 = 0.01712  ;  500 = 0.01464  ;  1000 = 0.0114 (USD); Sales Status: Active; Capacitance: 0.1µF; Voltage - Rated: 50V; Tolerance: ±10%; Mounting Type: Surface Mount- MLCC; Operating Temperature: -55°C ~ 125°C; Applications: General Purpose; Ratings: -; Package / Case: 0805 (2012 Metric); Size / Dimension: 0.079" L x 0.049" W (2.00mm x 1.25mm); Height - Seated (Max): -; Thickness (Max): 0.053" (1.35mm); Lead Spacing: -; Features: -; Packaging: Cut Tape (CT); Lead Style: -; Package: 0805; Thickness: 135
C80 = EEE-FK1E331P: CAP ALUM 330UF 25V 20% SMD; Manufacturer: Panasonic Electronic Components; Lifetime @ Temp#: 2000 Hrs @ 105°C; Ripple Current: 600mA; Impedance: 160 mOhm; Surface Mount Land Size: 0.327" L x 0.327" W (8.30mm x 8.30mm); F40: 1P; Value: 330µF; Temperature Coefficient: Temperature Coefficient; Manufacturer Part Number: EEE-FK1E331P; ComponentLink1Description: Internal Datasheet; ComponentLink1URL: http://industrial.panasonic.com/www-cgi/jvcr13pz.cgi?E+PZ+3+ABA0120+EEEFK1E331P+7+WW; ComponentLink2Description: External Datasheet; ComponentLink2URL: http://industrial.panasonic.com/www-cgi/jvcr13pz.cgi?E+PZ+3+ABA0120+EEEFK1E331P+7+WW; Stocked: 0; Supplier 1: Digi-Key; Supplier Part Number 1: PCE3803CT-ND; Category: Capacitors; SortValue: 330000000; Sort Value Package: F_330000000; Pricing: 1 = 0.93  ;  50 = 0.5948  ;  100 = 0.5353  ;  250 = 0.46096 (USD); Sales Status: Active; Capacitance: 330µF; Voltage Rating: 25V; Tolerance: ±20%; Operating Temperature: -55°C ~ 105°C; Features: General Purpose; ESR (Equivalent Series Resistance): -; Mounting Type: Surface Mount; Package / Case: Radial- Can - SMD; Size / Dimension: 0.315" Dia (8.00mm); Height - Seated (Max): 0.402" (10.20mm); Lead Spacing: -; Packaging: Cut Tape (CT); Diameter: 8.00; Height: 10.20; Package: F
L1 = DO1608C-104_L: Manufacturer: Coilcraft; Part Number: DO1608C-104_L_; CategorySort: 300; Inductance (uH): 100; DCR Max (Ohms): 1.27; SRF typ (MHz): 9; Isat (A): 0.31; IRMS (A) 20 rise: 0.37; IRMS (A) 40 rise: 0.5; Shielding: Unshielded; Category: Inductors; Value: 100 uH 0.31A; Manufacturer Part Number: DO1608C-104_L; ComponentLink1Description: Internal Datasheet; ComponentLink1URL: http://www.coilcraft.com/pdf_viewer/showpdf.cfm?f=pdf_store:do1608c.pdf; ComponentLink2Description: External Datasheet; ComponentLink2URL: http://www.coilcraft.com/pdf_viewer/showpdf.cfm?f=pdf_store:do1608c.pdf; Stocked: 0; Sort Value: 100; Sort Value Package: DO1608C_100; Supplier 1: Coilcraft; Supplier Part Number 1: DO1608C-104_L; Supplier Unit Price 1: 0.88; Package: DO1608C; Height (mm): 2.92
U44 = VSK-S25-15U: CONV AC/DC 25W 15V 1.6A PCB; Manufacturer: CUI Inc; Number of Outputs: 1; Voltage - Input: 85 ~ 264 VAC; Power Supply Type: Switching (Closed Frame); Efficiency: 83%; Power (Watts) - Max: 24W; Line Regulation: ±0.5%; Load Regulation: ±1%; Approvals: CE, cULus, EN, IEC; Value: VSK-S25-15U; Supplier 1: Digi-Key; Supplier Part Number 1: 102-2413-ND; Manufacturer Part Number: VSK-S25-15U; RoHS: RoHS Compliant; Category: Power Supplies - Board Mount; Stock 1: 77; Pricing 1: 1=33.85, 5=32.852, 10=31.856, 50=29.865, 100=28.8695, 250=27.874, 500=27.37626 (USD); Voltage - Output 1: 15V; Voltage - Output 2: -; Voltage - Output 3: -; Voltage - Output 4: -; Current - Output (Max): 1.6A; Power (Watts): 25W; Applications: Commercial; Features: OCP, OTP, OVP, SCP; Operating Temperature: -25°C ~ 70°C; Mounting Type: Through Hole; Size / Dimension: 2.75" L x 1.89" W x 0.94" H (70.0mm x 48.0mm x 24.0mm); Weight: 0.265 lb (120.2g); ComponentLink1URL: http://www.cui.com/Product/Resource/DigiKeyPDF/VSK-S25.pdf; ComponentLink1Description: http://www.cui.com/Product/Resource/DigiKeyPDF/VSK-S25.pdf
U45 = VSK-S5-15UA: CONV AC/DC 5W 15V 0.33A PCB; Manufacturer: CUI Inc; Number of Outputs: 1; Voltage - Input: 85 ~ 264 VAC; Current - Output (Max): 330mA; Power Supply Type: Switching (Closed Frame); Efficiency: 76%; Line Regulation: ±0.5%; Load Regulation: ±1%; Approvals: CE, cULus, EN; Value: VSK-S5-15UA; Supplier 1: Digi-Key; Supplier Part Number 1: 102-2389-ND; Manufacturer Part Number: VSK-S5-15UA; RoHS: RoHS Compliant; Category: Power Supplies - Board Mount; Stock 1: 248; Pricing 1: 1=16.33, 5=16.094, 10=15.861, 50=14.4616, 100=13.995, 250=13.52852, 500=13.062 (USD); Voltage - Output 1: 15V; Voltage - Output 2: -; Voltage - Output 3: -; Voltage - Output 4: -; Power (Watts): 5W; Applications: Commercial; Features: OTP, OVP, SCP; Operating Temperature: -25°C ~ 70°C; Mounting Type: Through Hole; Size / Dimension: 2.00" L x 1.00" W x 0.62" H (50.8mm x 25.4mm x 15.7mm); Power (Watts) - Max: 5W; Weight: 0.077 lb (34.93g); ComponentLink1URL: http://www.cui.com/Product/Resource/DigiKeyPDF/VSK-S5_Series.pdf; ComponentLink1Description: http://www.cui.com/Product/Resource/DigiKeyPDF/VSK-S5_Series.pdf
U46 = VSK-S5-5UA: CONV AC/DC 5W 5V 1A PCB; Manufacturer: CUI Inc; Number of Outputs: 1; Voltage - Input: 85 ~ 264 VAC; Power Supply Type: Switching (Closed Frame); Efficiency: 72%; Line Regulation: ±0.5%; Load Regulation: ±1%; Approvals: CE, cULus, EN; Value: VSK-S5-5UA; Supplier 1: Digi-Key; Supplier Part Number 1: 102-2386-ND; Manufacturer Part Number: VSK-S5-5UA; RoHS: RoHS Compliant; Category: Power Supplies - Board Mount; Stock 1: 1594; Pricing 1: 1=16.33, 5=16.094, 10=15.861, 50=14.4616, 100=13.995, 250=13.52852, 500=13.062 (USD); Voltage - Output 1: 5V; Voltage - Output 2: -; Voltage - Output 3: -; Voltage - Output 4: -; Current - Output (Max): 1A; Power (Watts): 5W; Applications: Commercial; Features: OTP, OVP, SCP; Operating Temperature: -25°C ~ 70°C; Mounting Type: Through Hole; Size / Dimension: 2.00" L x 1.00" W x 0.62" H (50.8mm x 25.4mm x 15.7mm); Power (Watts) - Max: 5W; Weight: 0.077 lb (34.93g); ComponentLink1URL: http://www.cui.com/Product/Resource/DigiKeyPDF/VSK-S5_Series.pdf; ComponentLink1Description: http://www.cui.com/Product/Resource/DigiKeyPDF/VSK-S5_Series.pdf
U49 = G6B-2214P-US DC5: as U49 on sheet MCU; Supplier 1: Digi-Key; Supplier Part Number 1: Z947-ND; Manufacturer Part Number: G6B-2214P-US DC5; RoHS: RoHS Compliant; Category: Relays; Stock 1: 2840; Pricing 1: 1=7.27, 10=6.816, 25=6.0584, 50=5.7556, 100=5.4526, 250=4.84676, 500=4.54384, 1000=4.24092, 2500=4.16519 (USD); Packaging: Bulk; Relay Type: General Purpose; Contact Rating (Current): 5A; Release Time: 10ms; Features: Sealed - Fully; Mounting Type: Through Hole; Termination Style: PC Pin; Contact Material: Silver Alloy, Cadmium Free; Operating Temperature: -25°C ~ 70°C; ComponentLink1URL: http://www.components.omron.com/components/web/PDFLIB.nsf/0/4287C4A29AD8E88785257201007DD690/$file/G6B_0911.pdf; ComponentLink1Description: http://www.components.omron.com/components/web/PDFLIB.nsf/0/4287C4A29AD8E88785257201007DD690/$file/G6B_0911.pdf; Value: G6B-2214P-US DC5
U68 = LD1117S33CTR: IC REG LDO 3.3V 950MA SOT-223; Manufacturer: STMicroelectronics; Regulator Topology: Positive Fixed; Voltage - Input: Up to 15V; Voltage - Dropout (Typical): 1.1V @ 800mA; Number of Regulators: 1; Supplier 1: Digi-Key; Supplier Part Number 1: 497-1241-1-ND; Manufacturer Part Number: LD1117S33CTR; RoHS: RoHS Compliant; Category: Integrated Circuits (ICs); Stock 1: 20460; Pricing 1: 1=0.54, 10=0.436, 100=0.3267, 250=0.28216, 500=0.24256, 1000=0.1881 (USD); Voltage - Output: 3.3V; Current - Output: 950mA; Current - Limit (Min): -; Operating Temperature: -40°C ~ 125°C; Mounting Type: Surface Mount; Package / Case: TO-261-4, TO-261AA; Supplier Device Package: SOT-223; Packaging: Cut Tape (CT); ComponentLink1URL: http://www.st.com/internet/com/TECHNICAL_RESOURCES/TECHNICAL_LITERATURE/DATASHEET/CD00000544.pdf; ComponentLink1Description: http://www.st.com/internet/com/TECHNICAL_RESOURCES/TECHNICAL_LITERATURE/DATASHEET/CD00000544.pdf; value: LD1117S33CTR